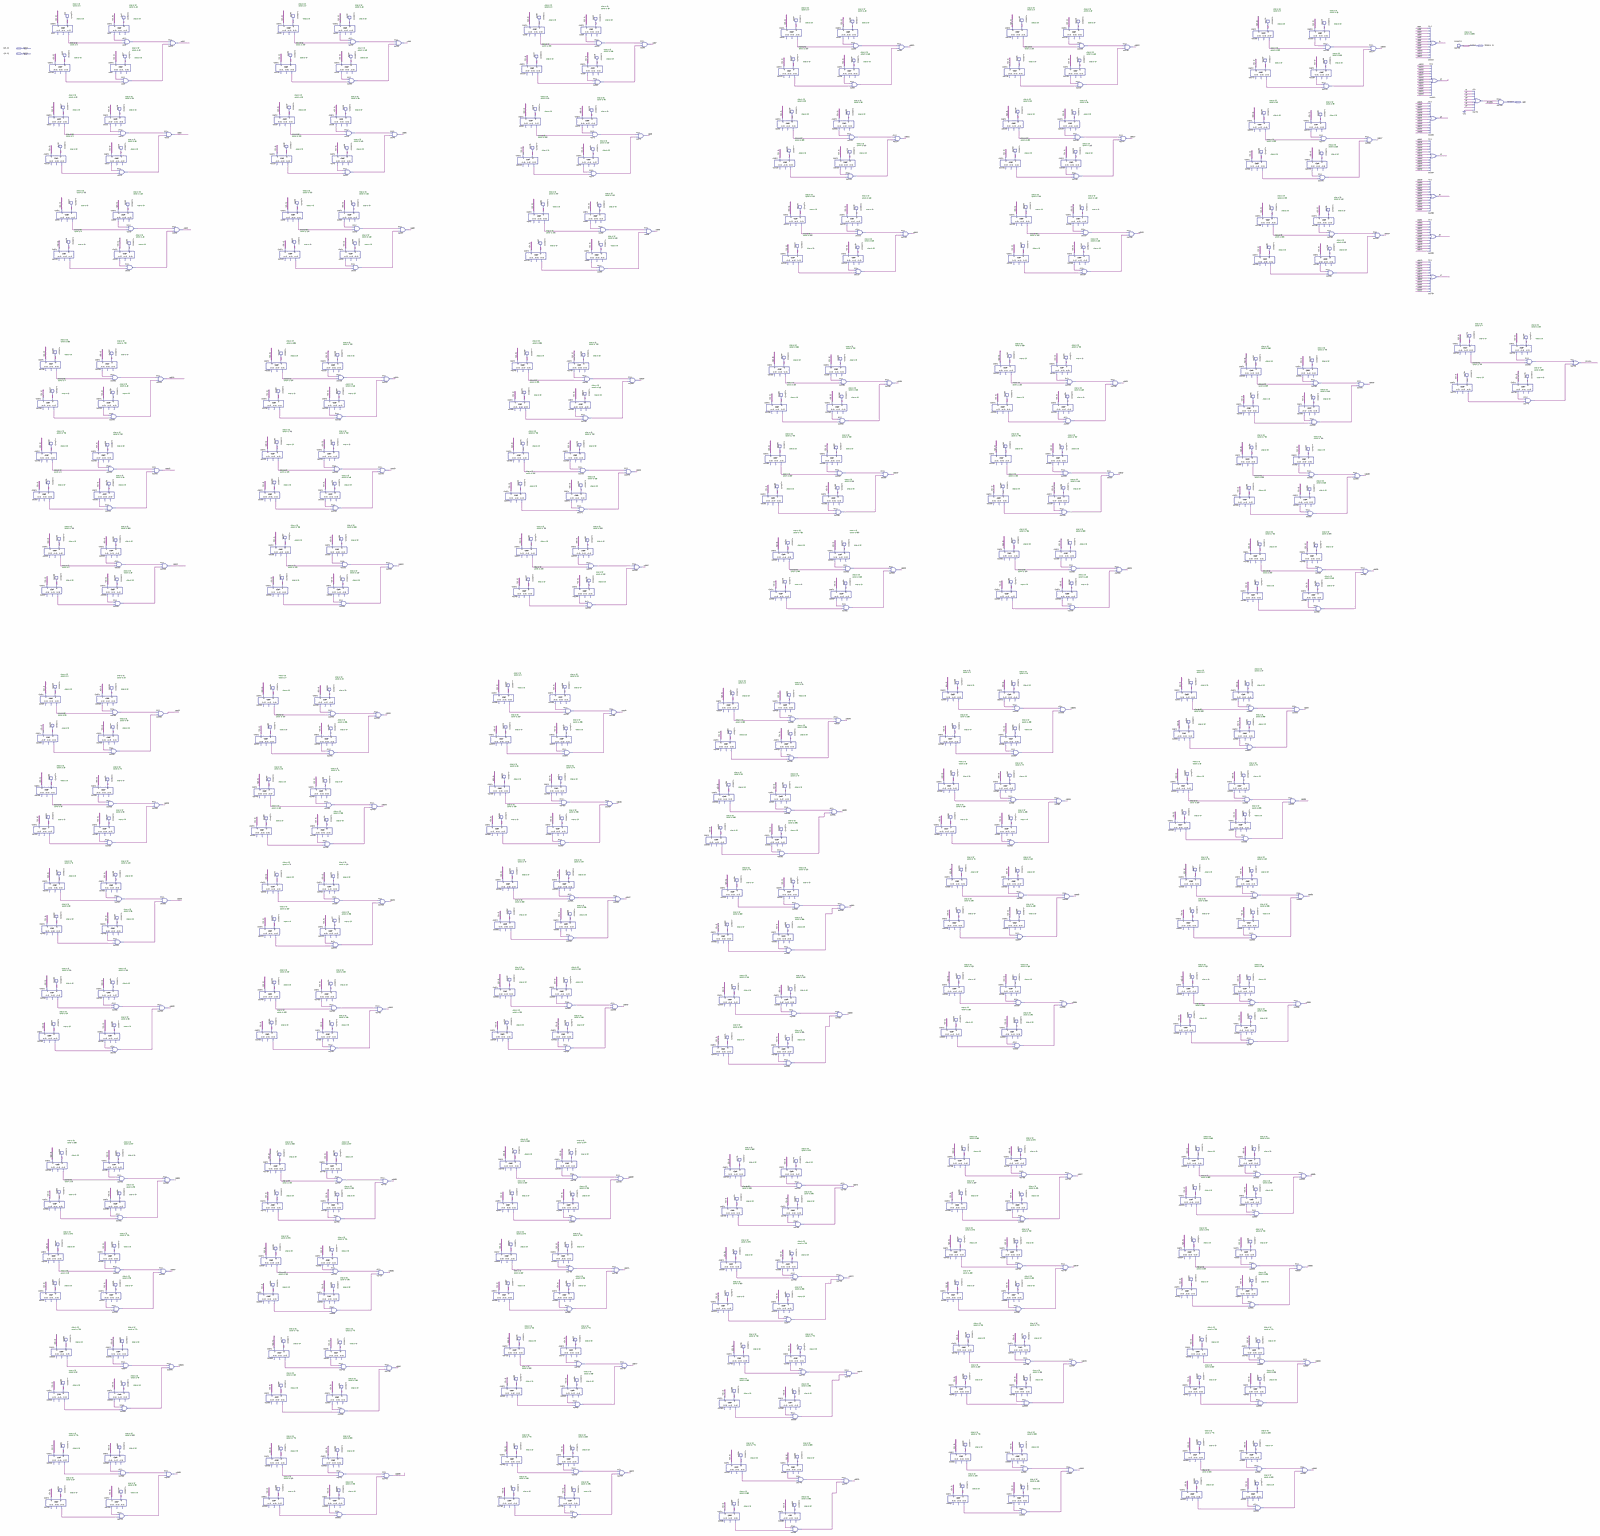
[diagram p0: schematic sheet, whole]
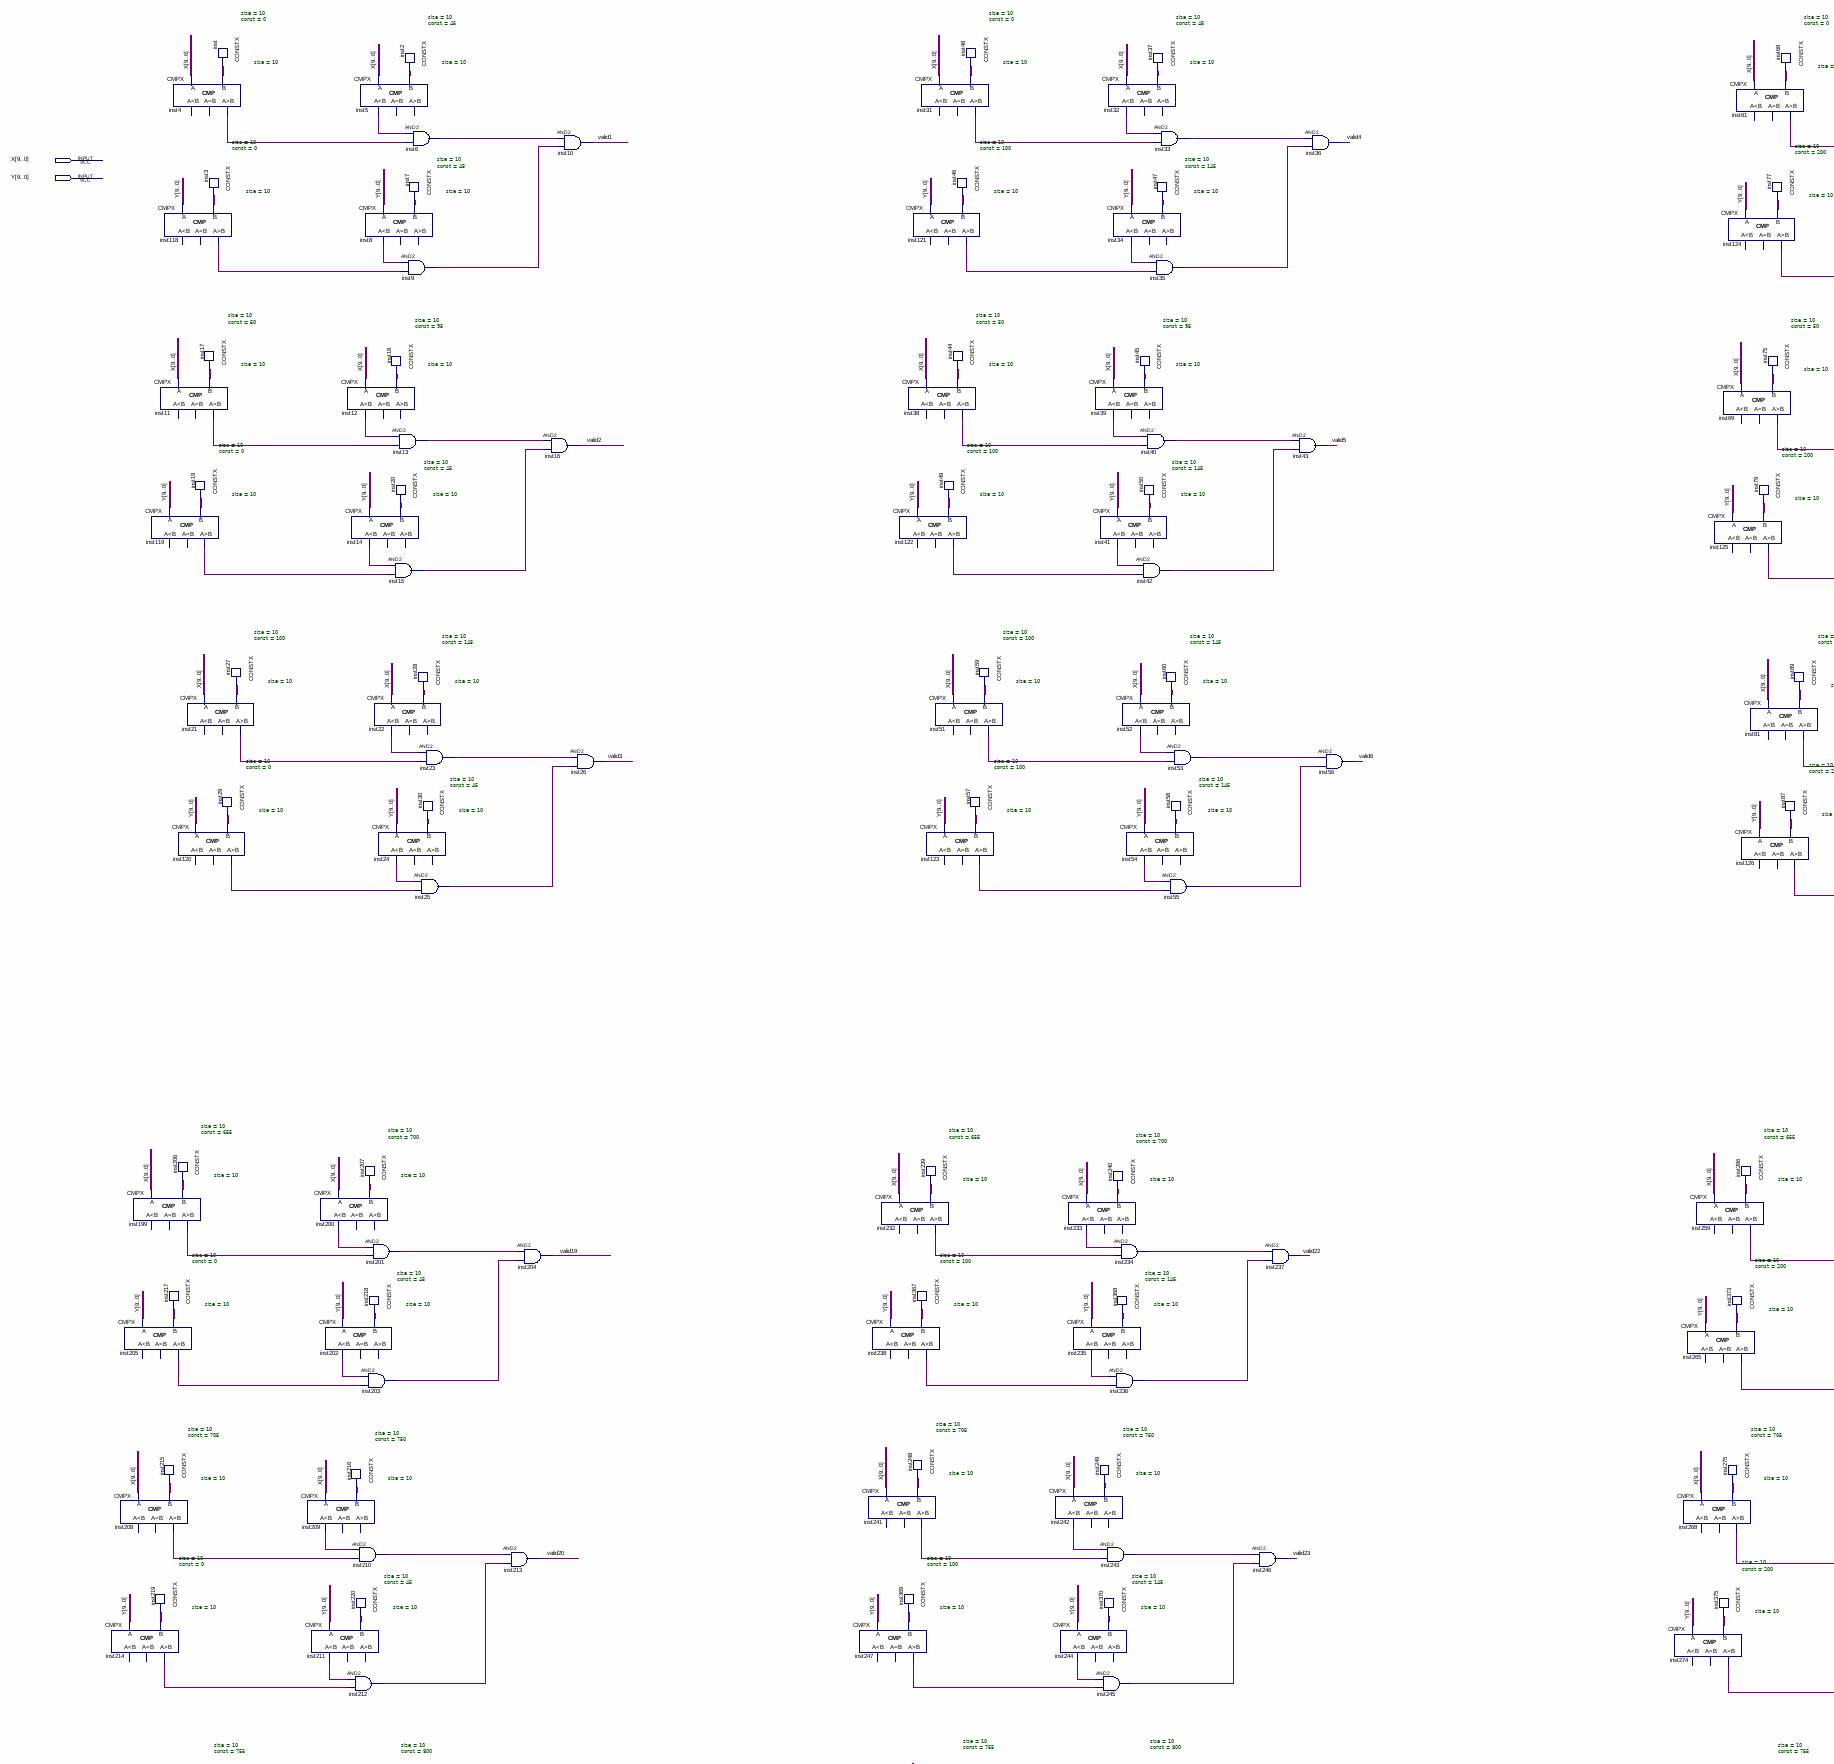
[diagram p1: schematic sheet, upper left part]
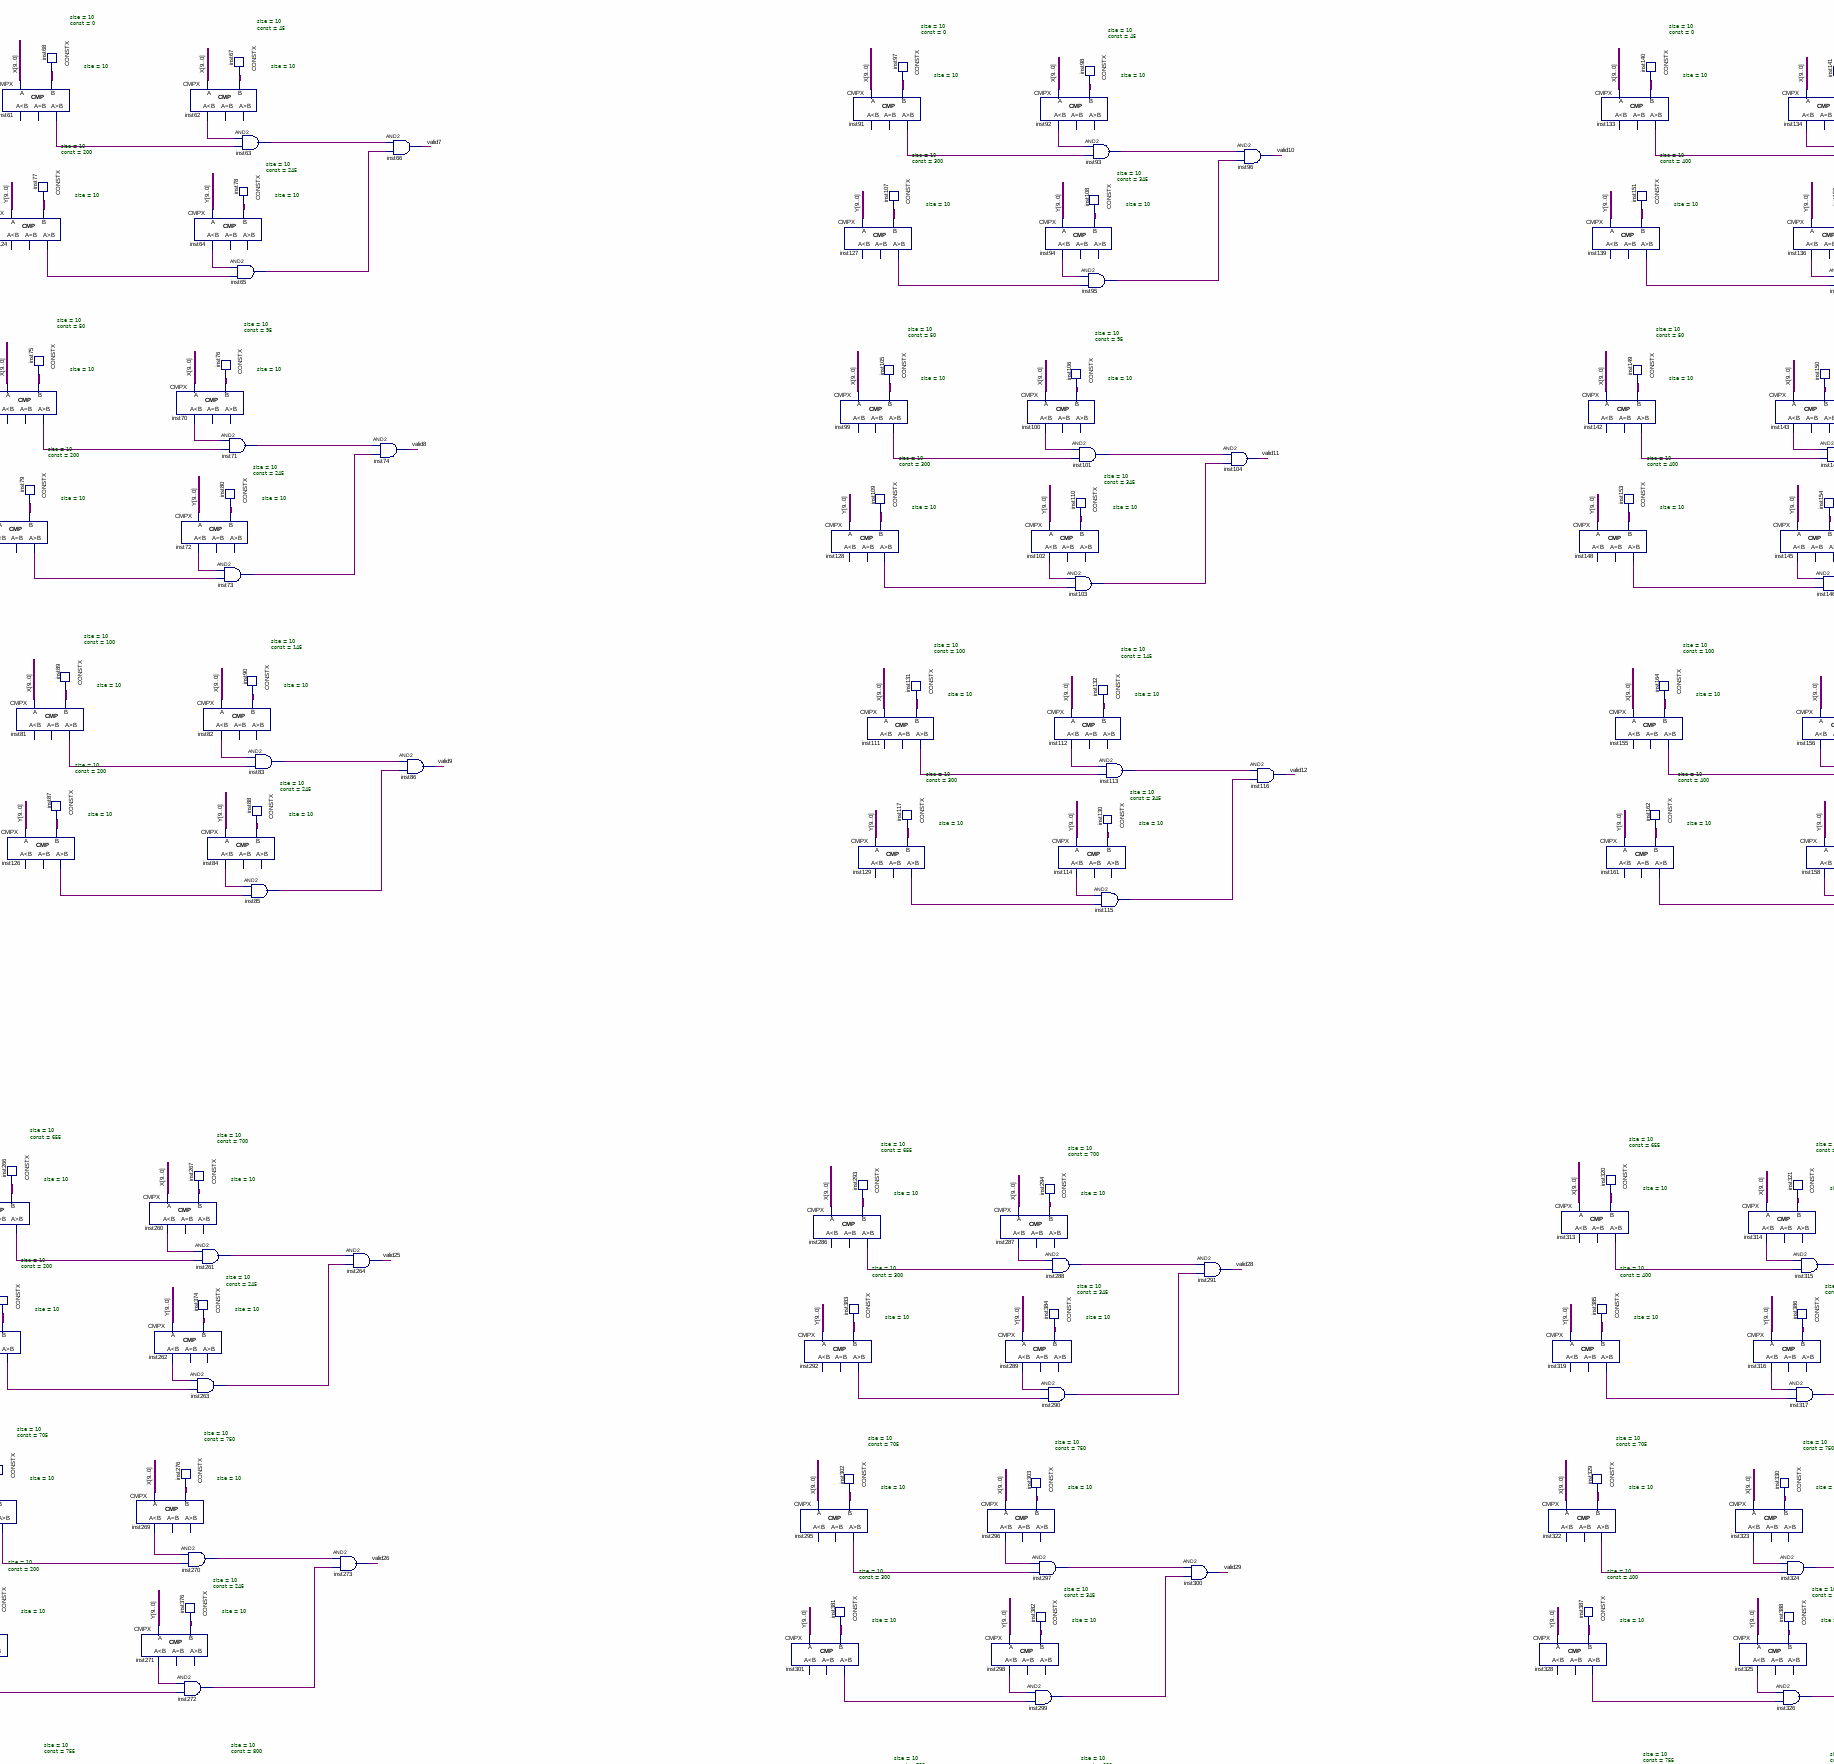
[diagram p2: schematic sheet, upper centre part]
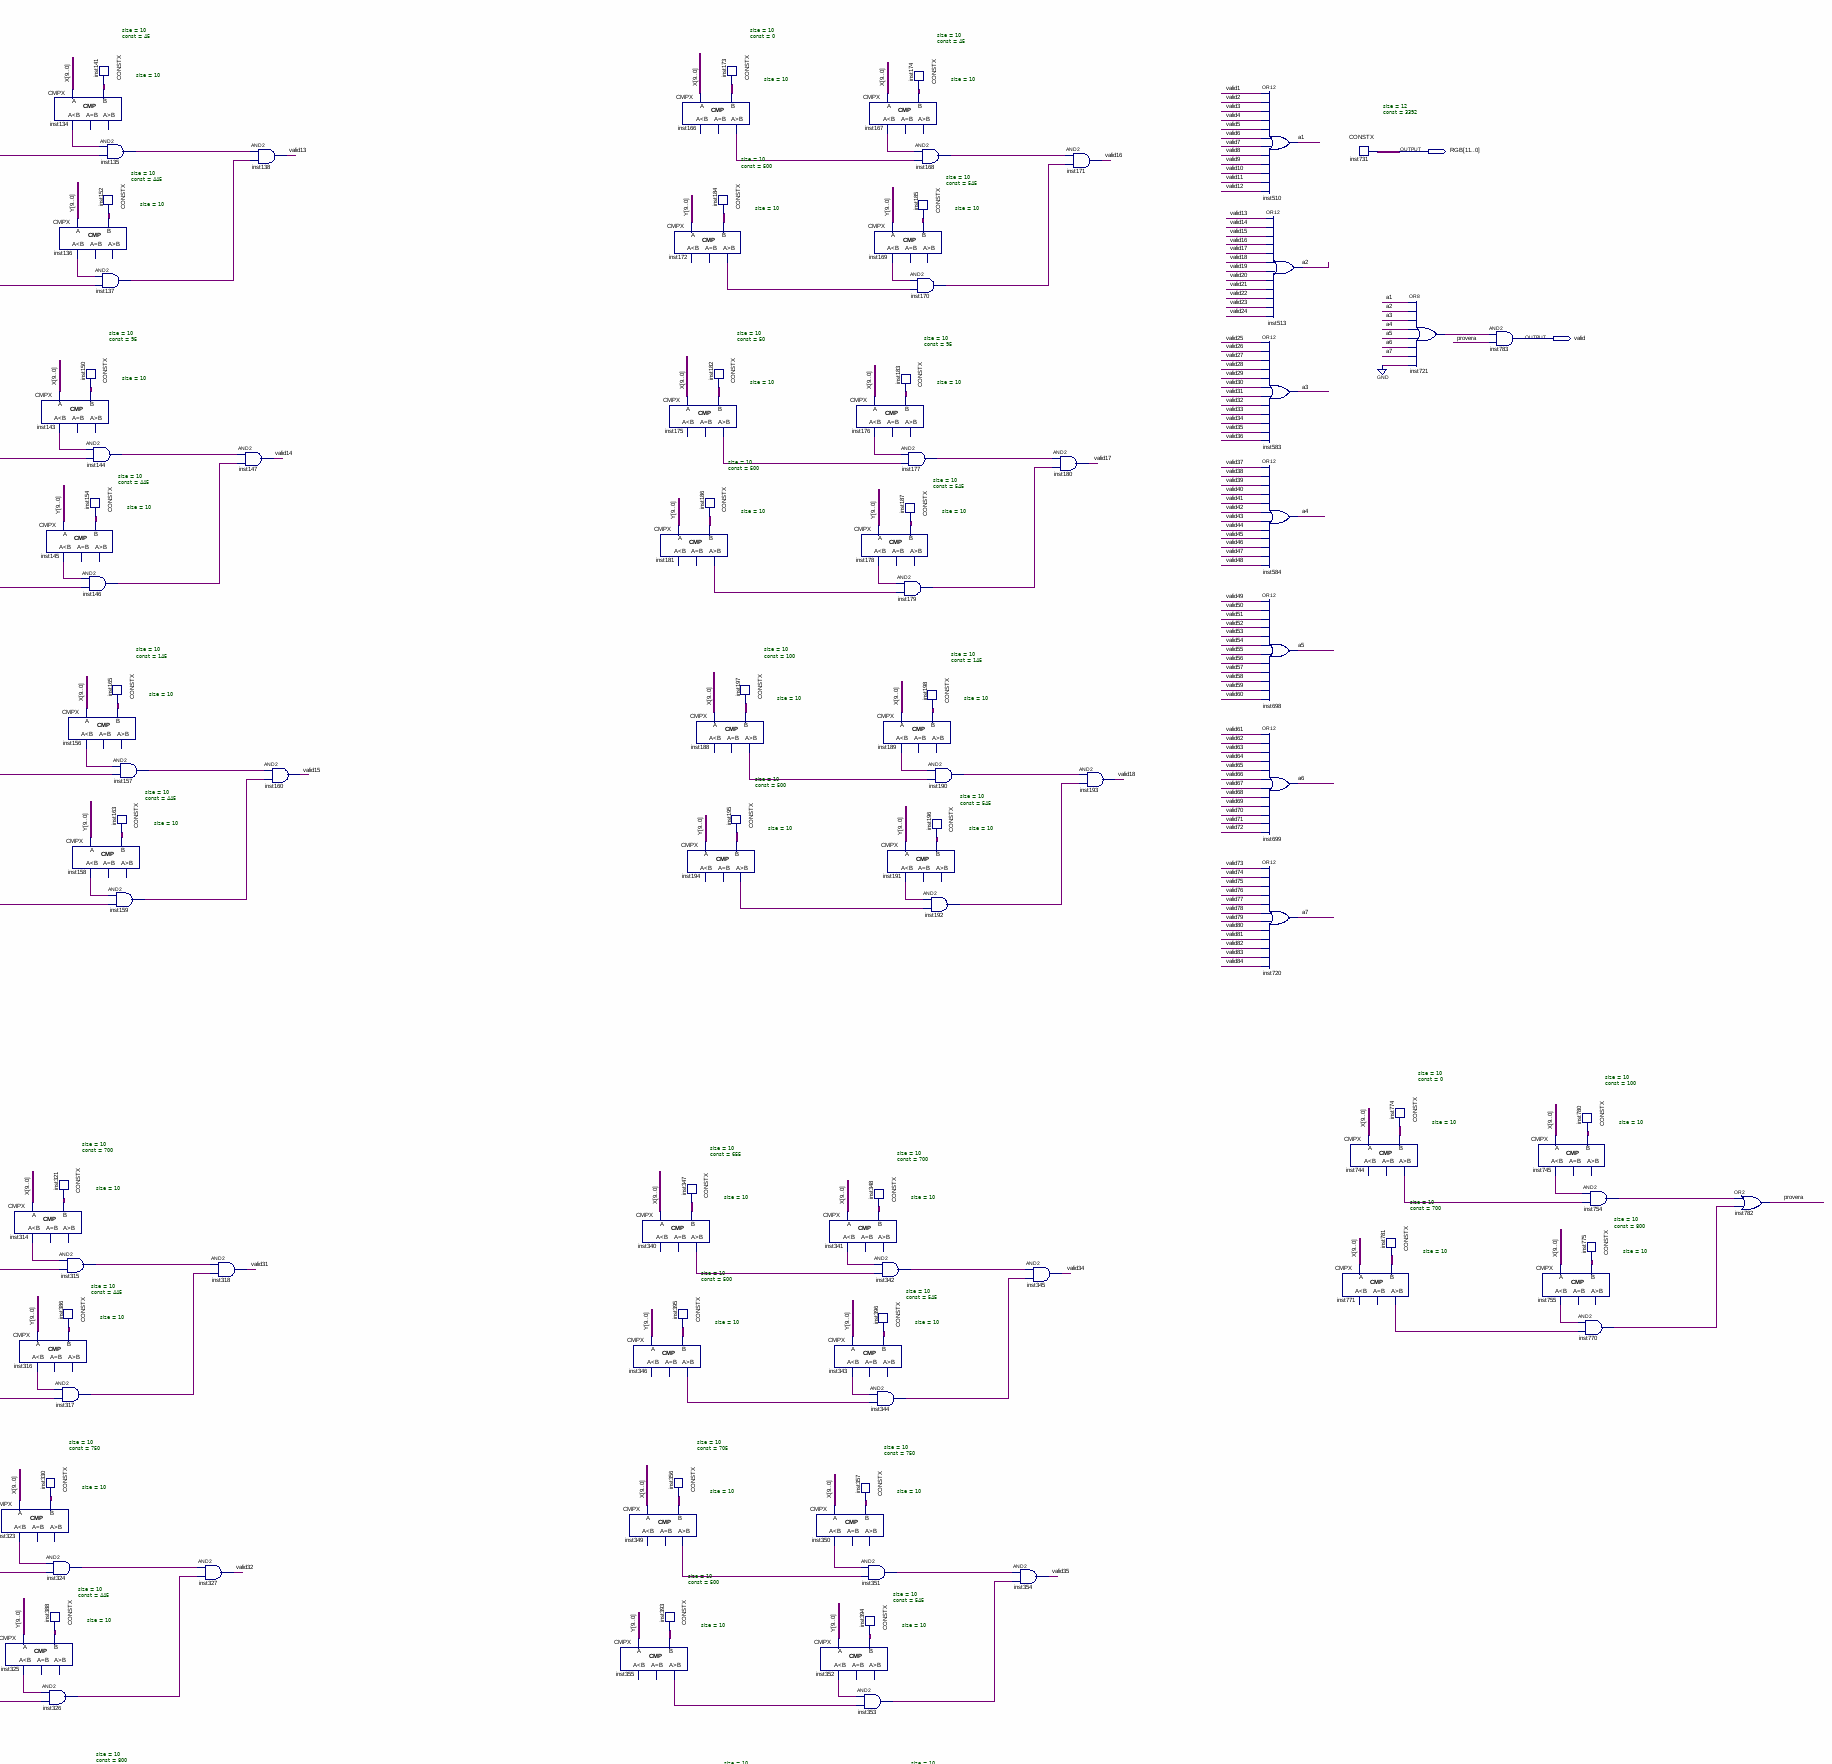
[diagram p3: schematic sheet, upper right part]
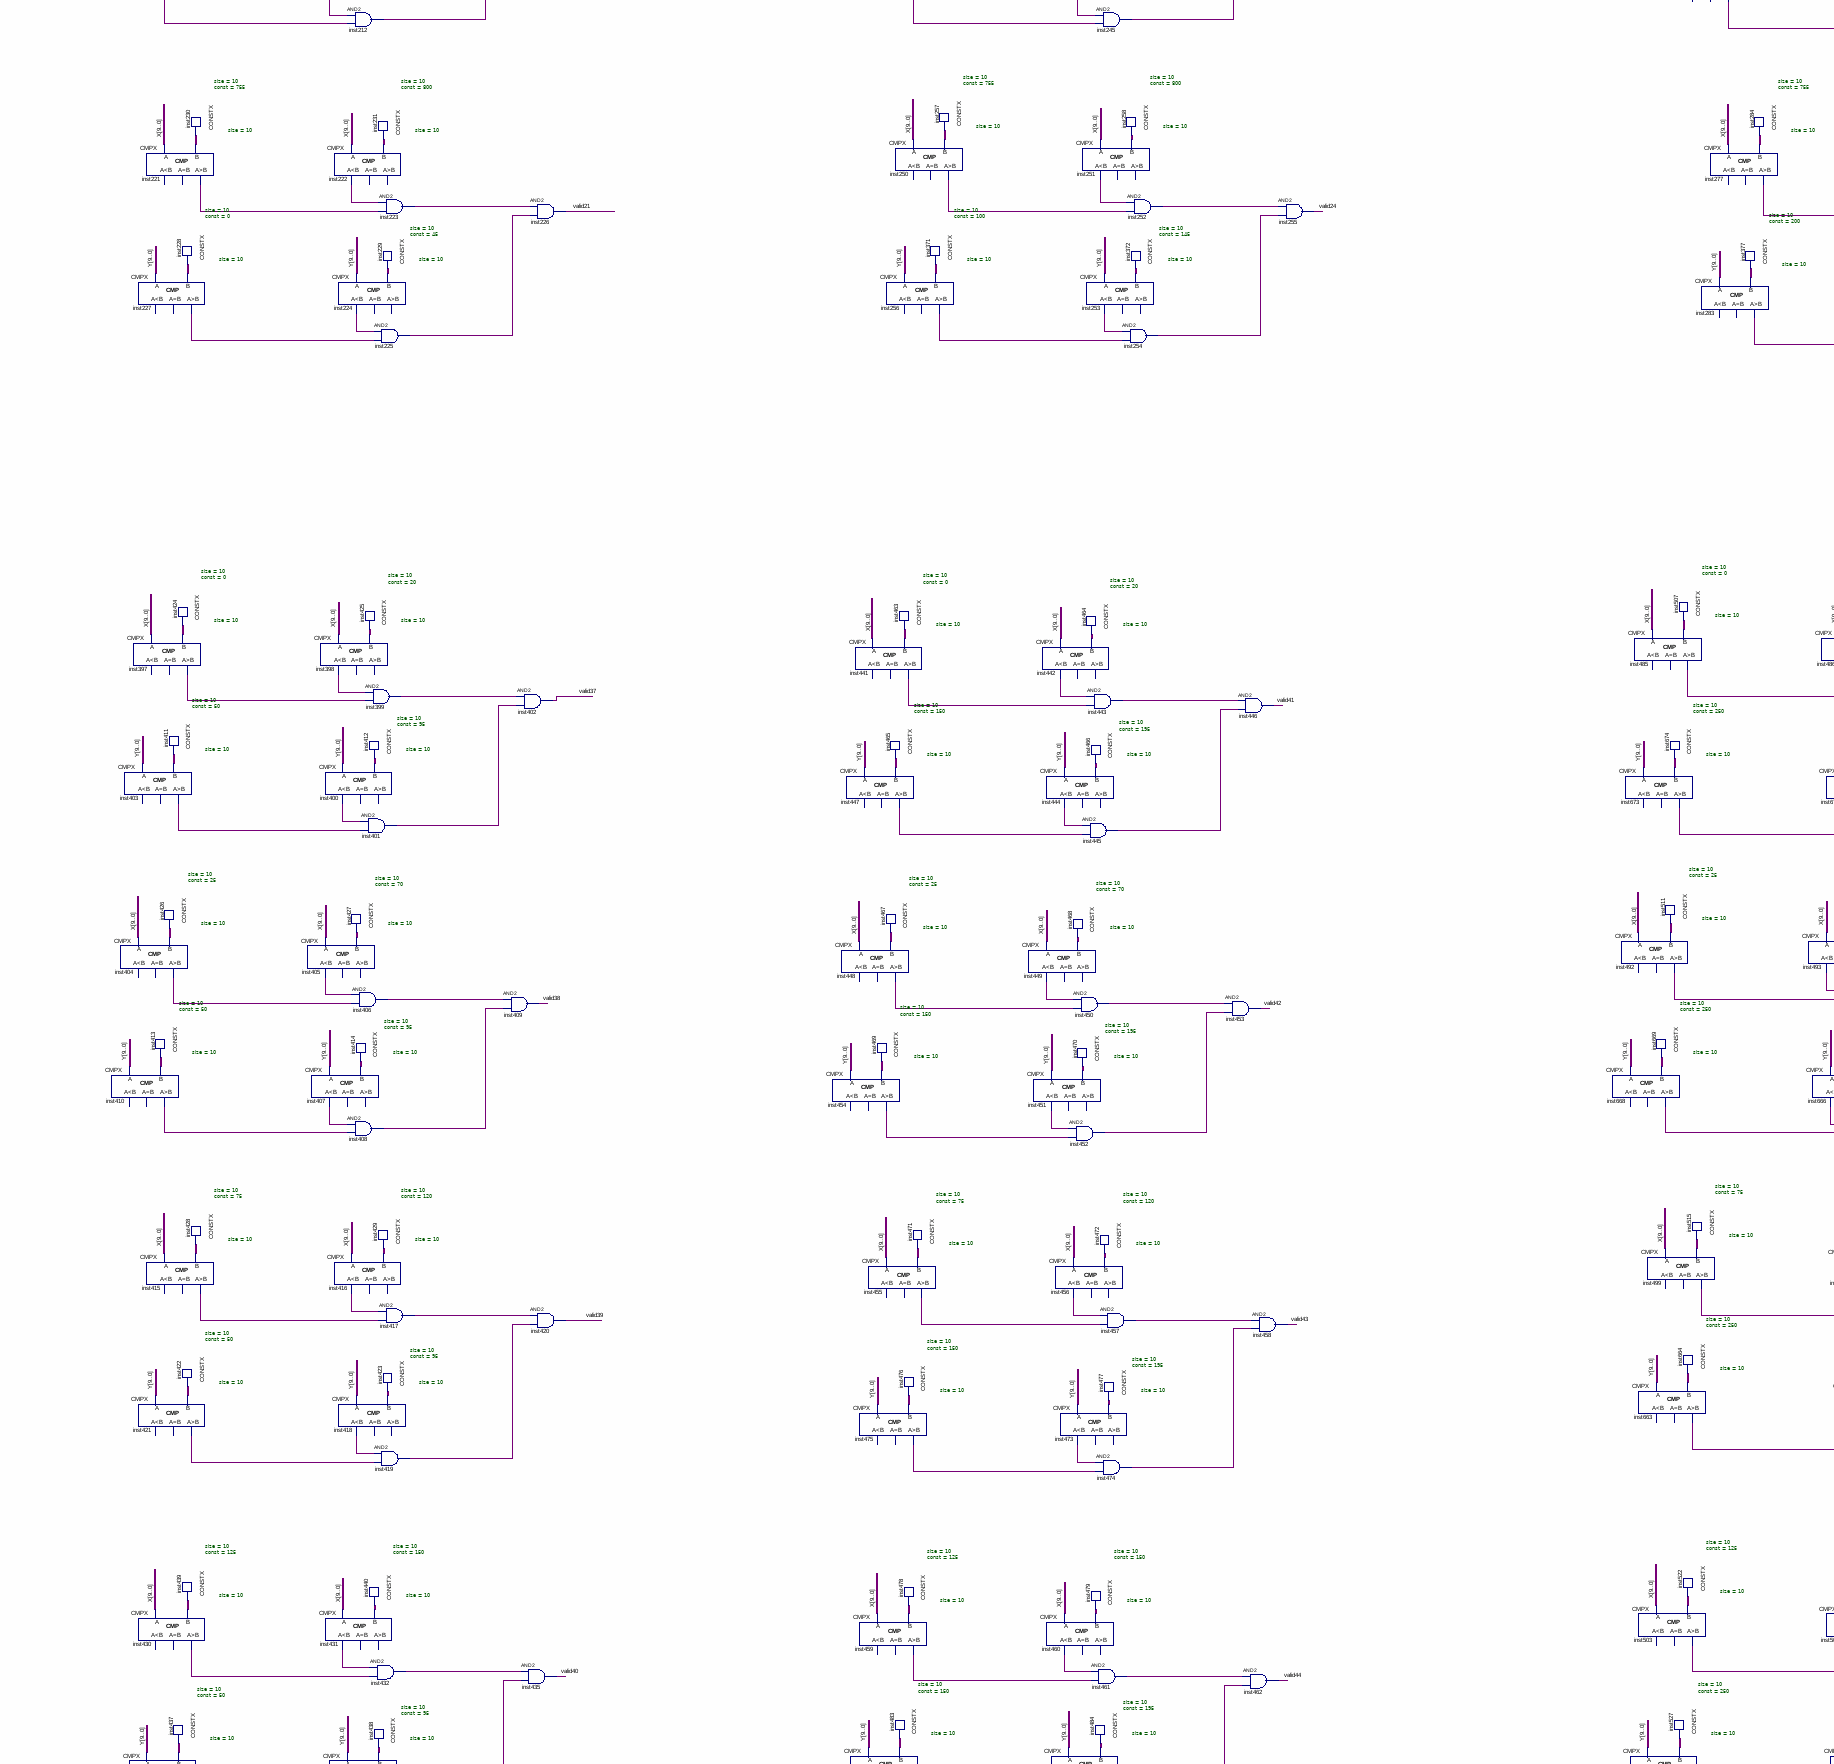
[diagram p4: schematic sheet, middle left part]
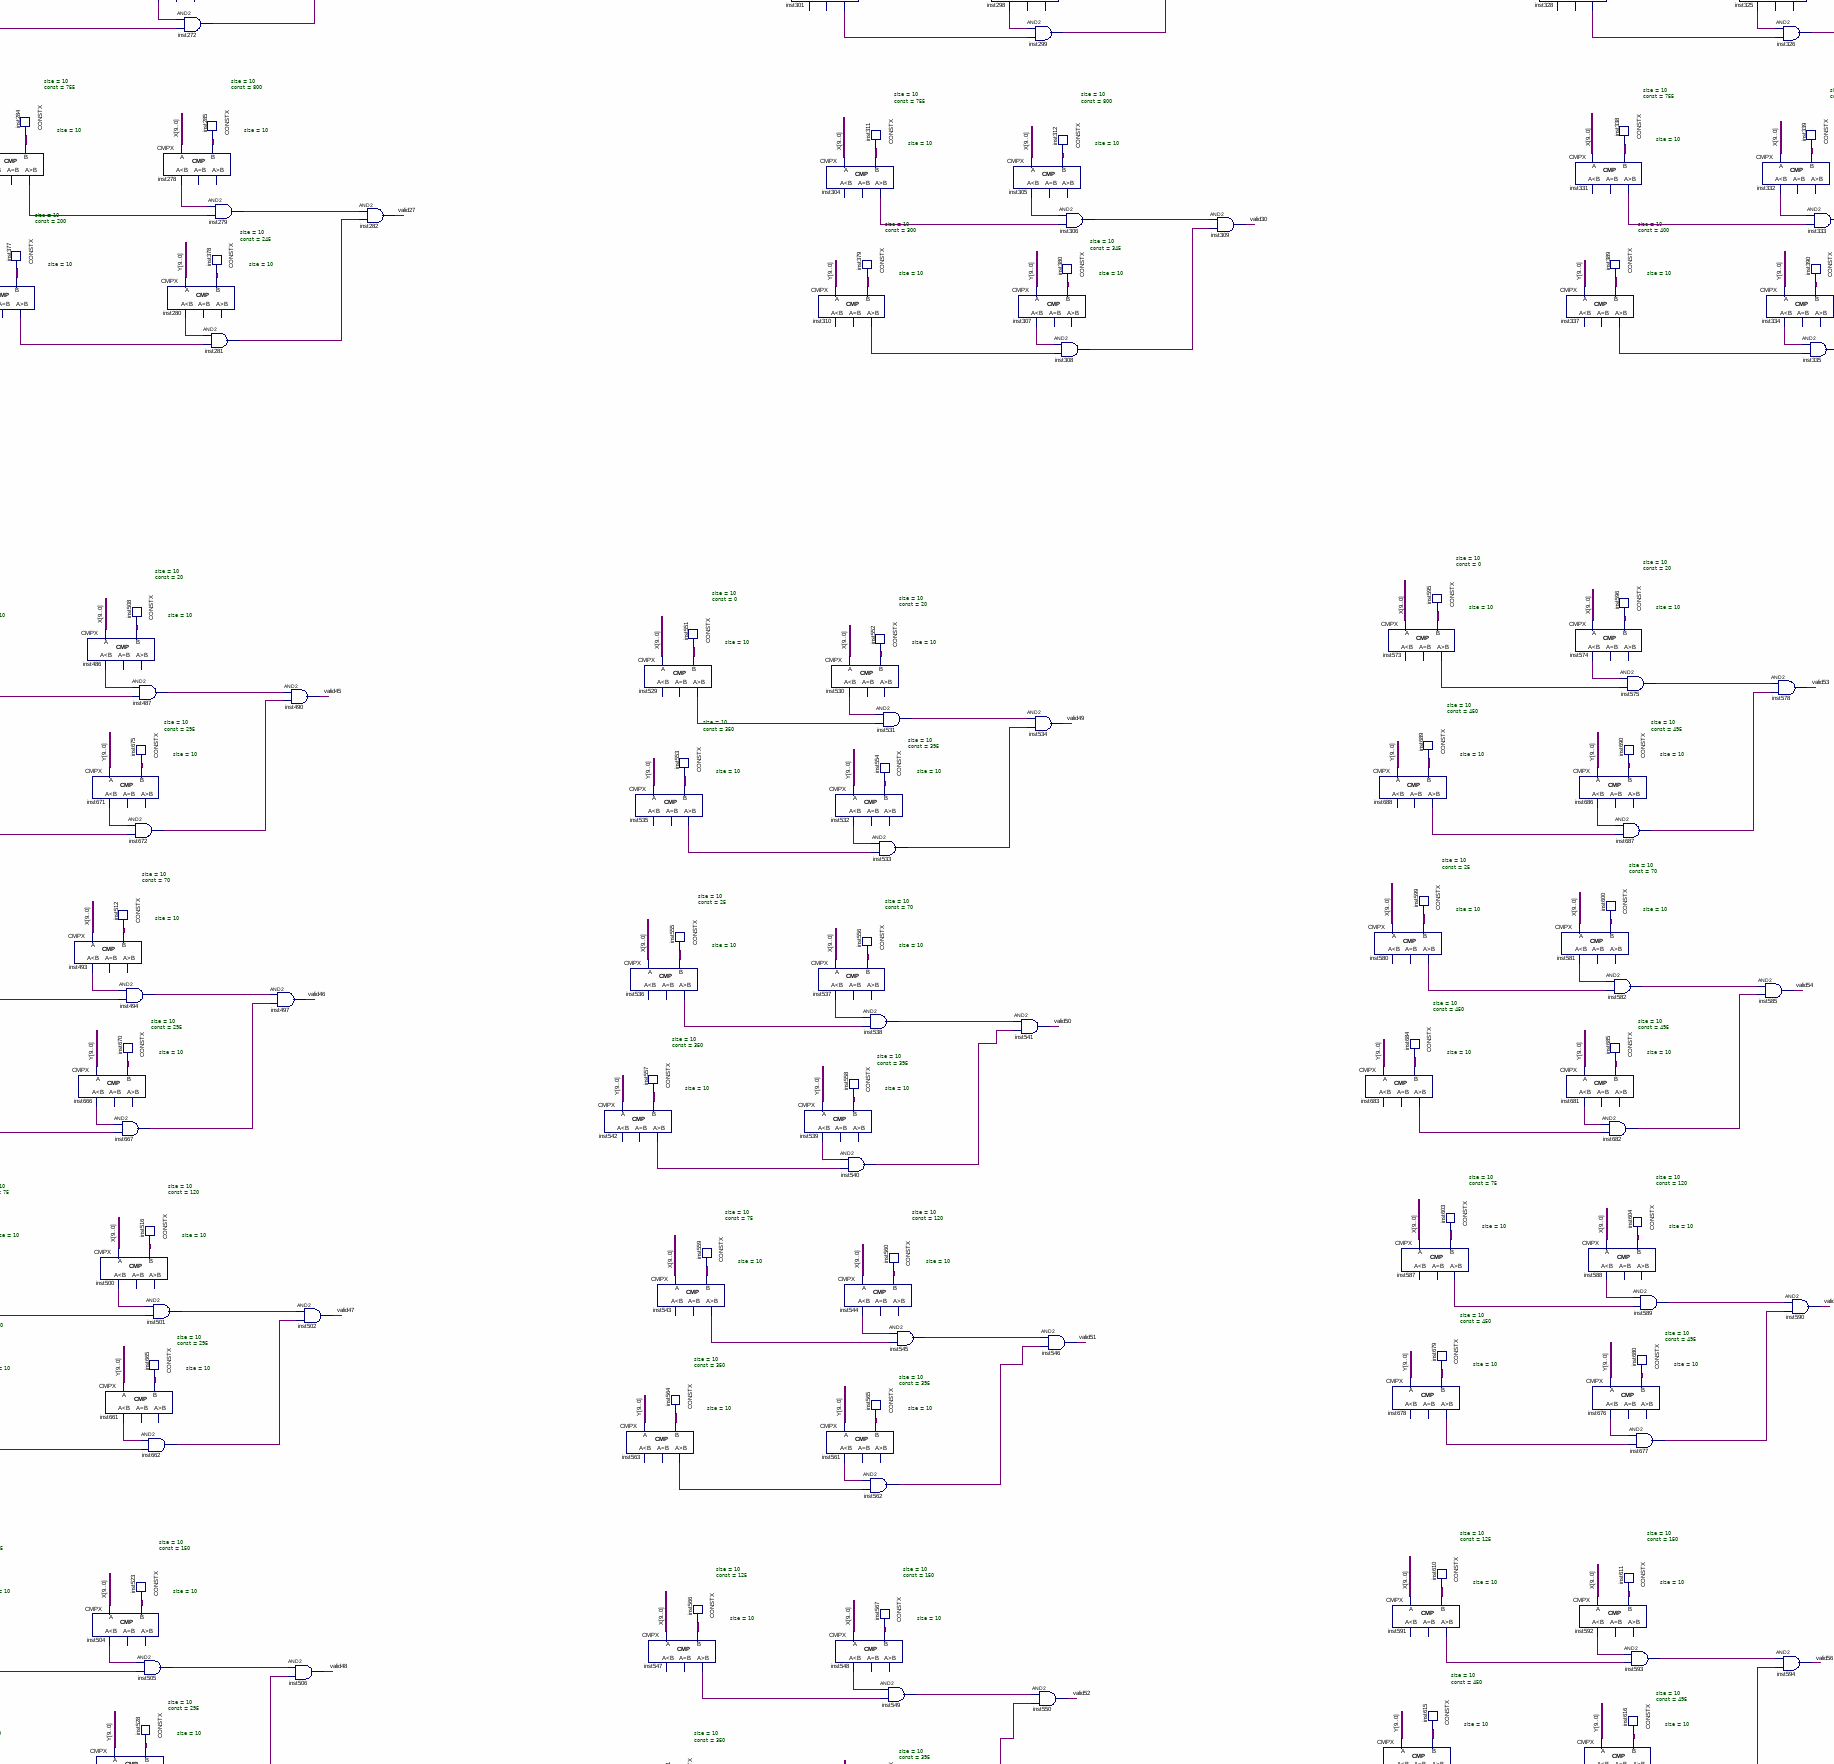
[diagram p5: schematic sheet, middle centre part]
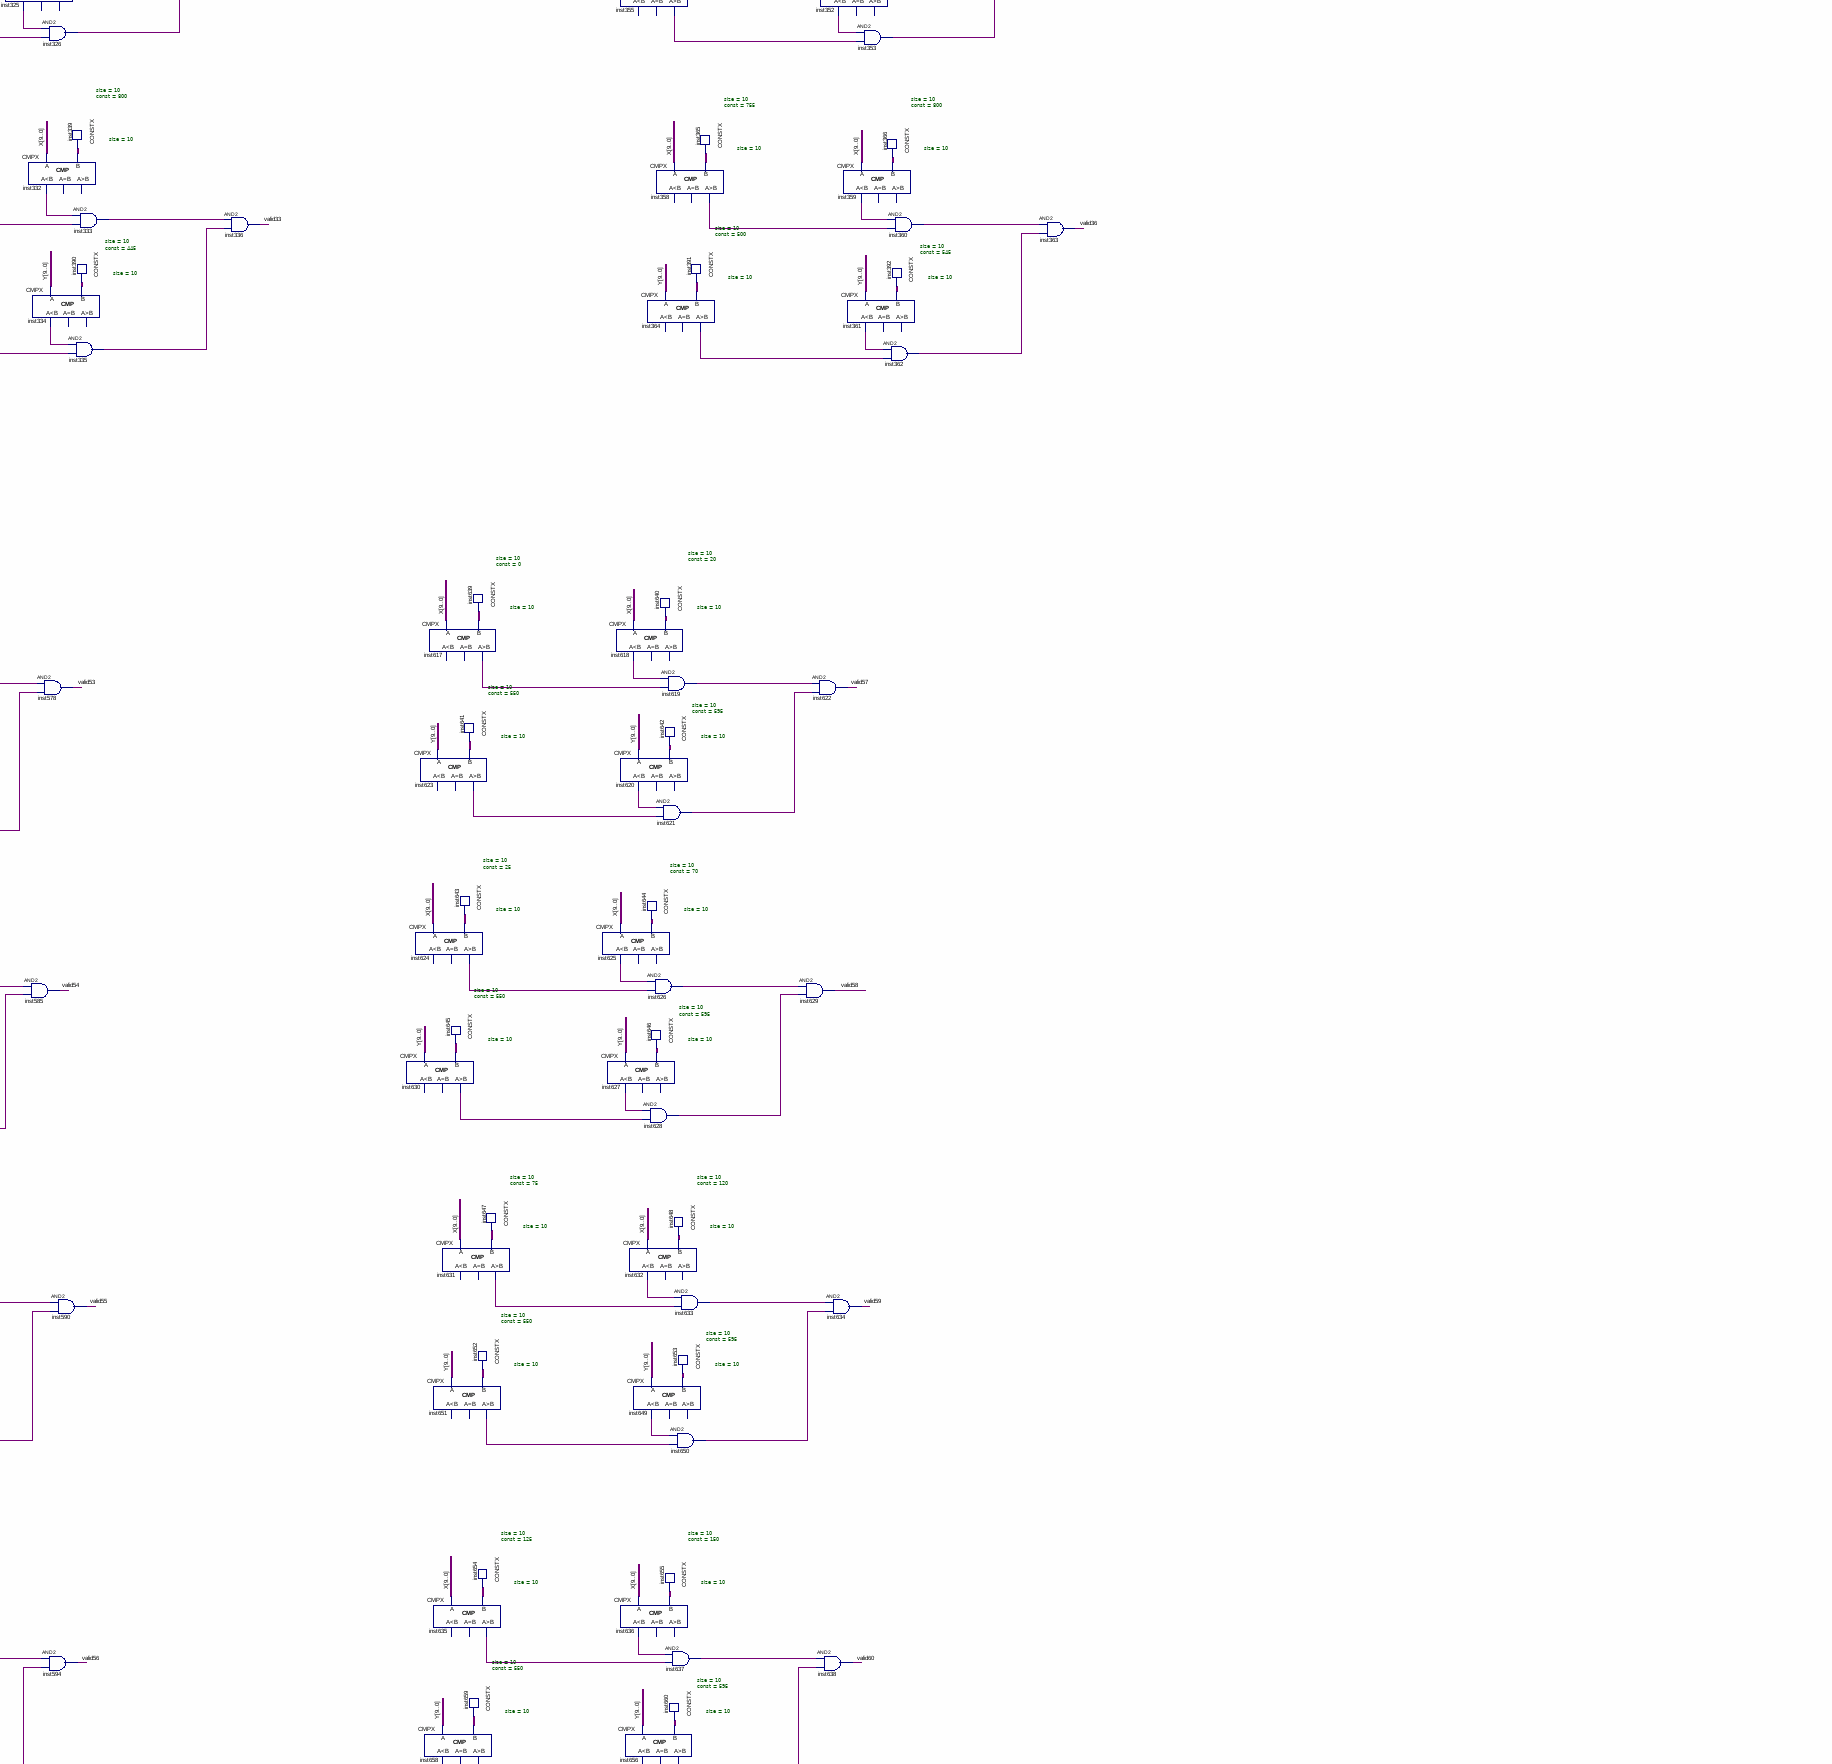
[diagram p6: schematic sheet, middle right part]
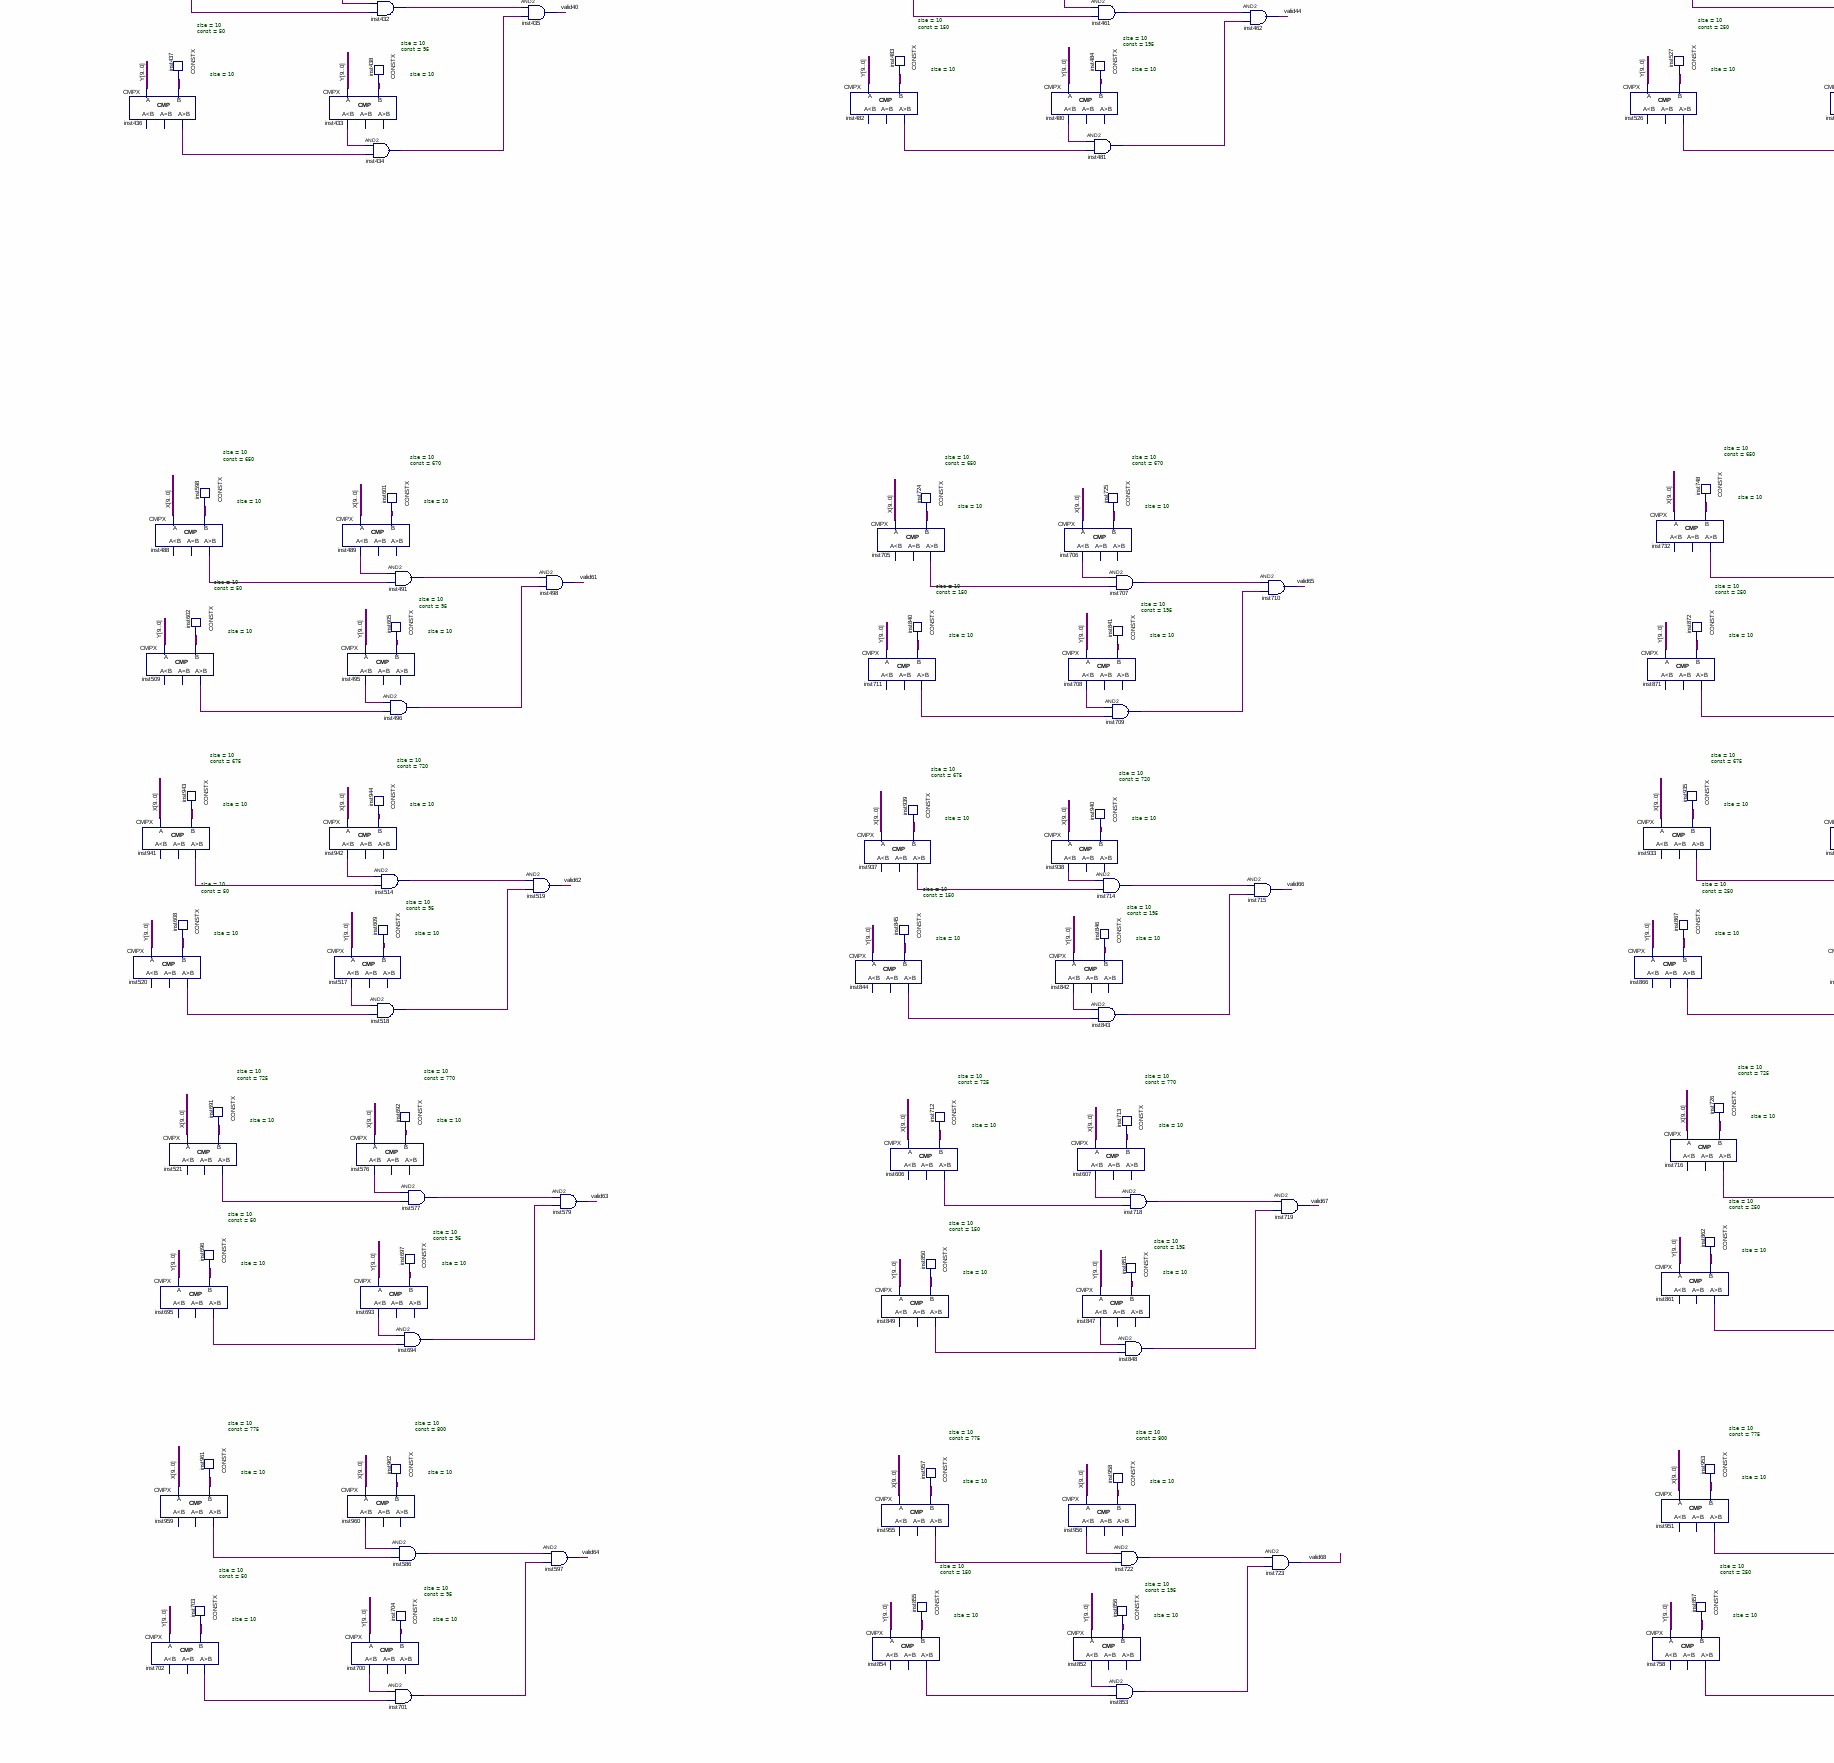
[diagram p7: schematic sheet, lower left part]
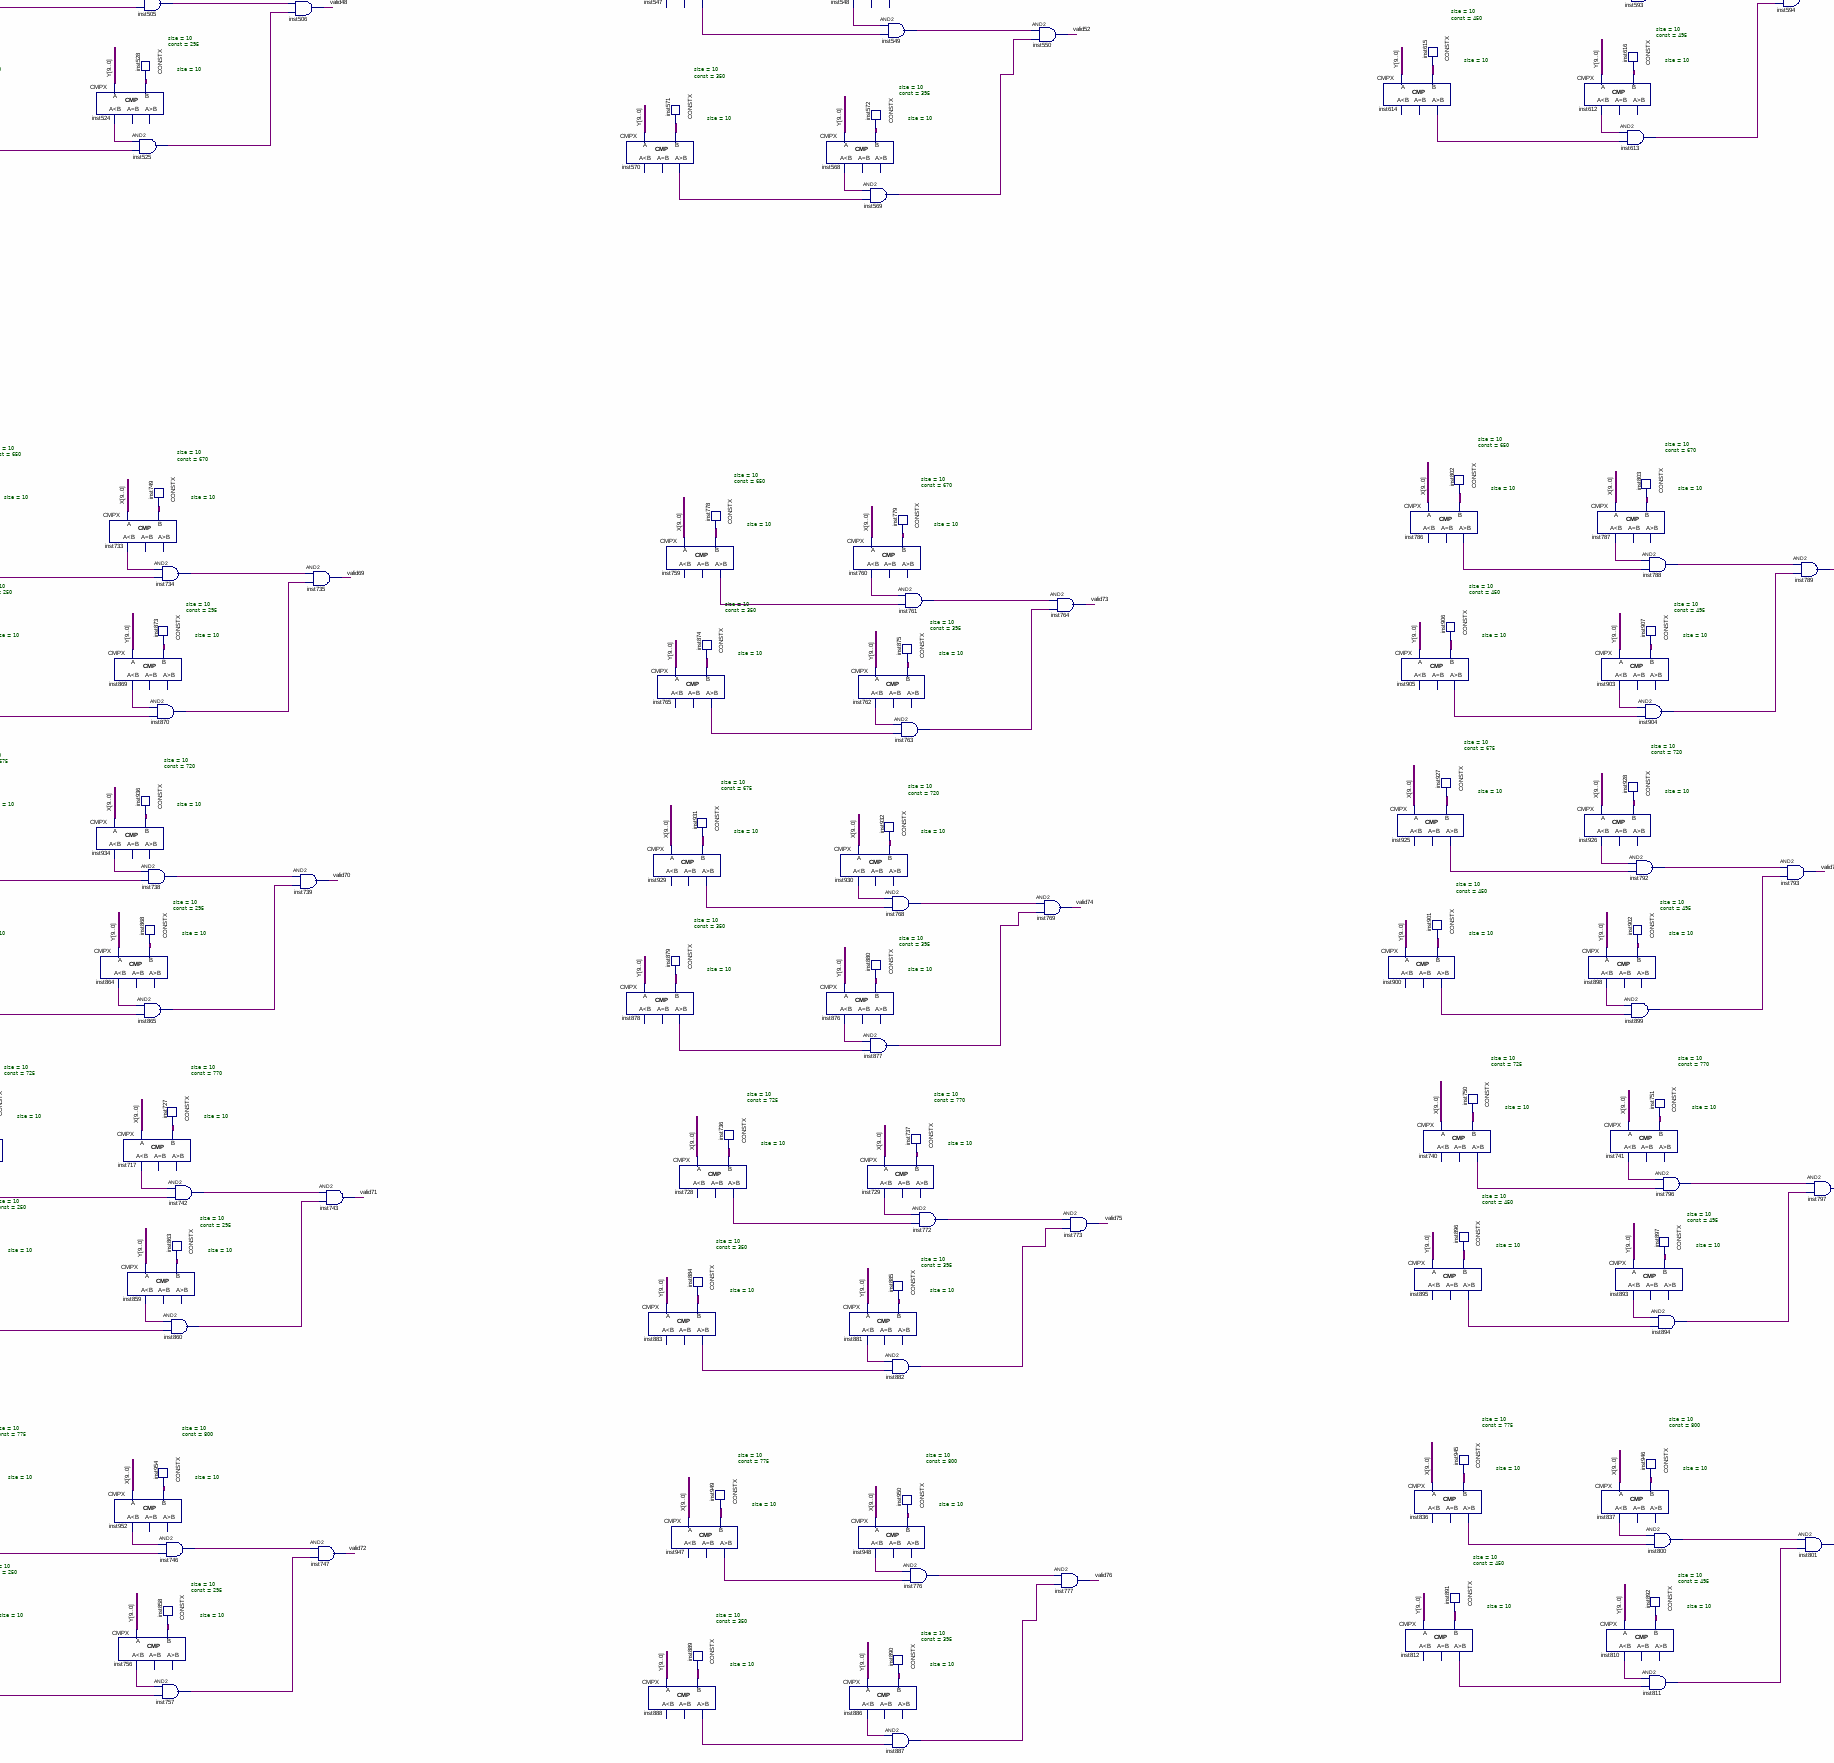
[diagram p8: schematic sheet, lower centre part]
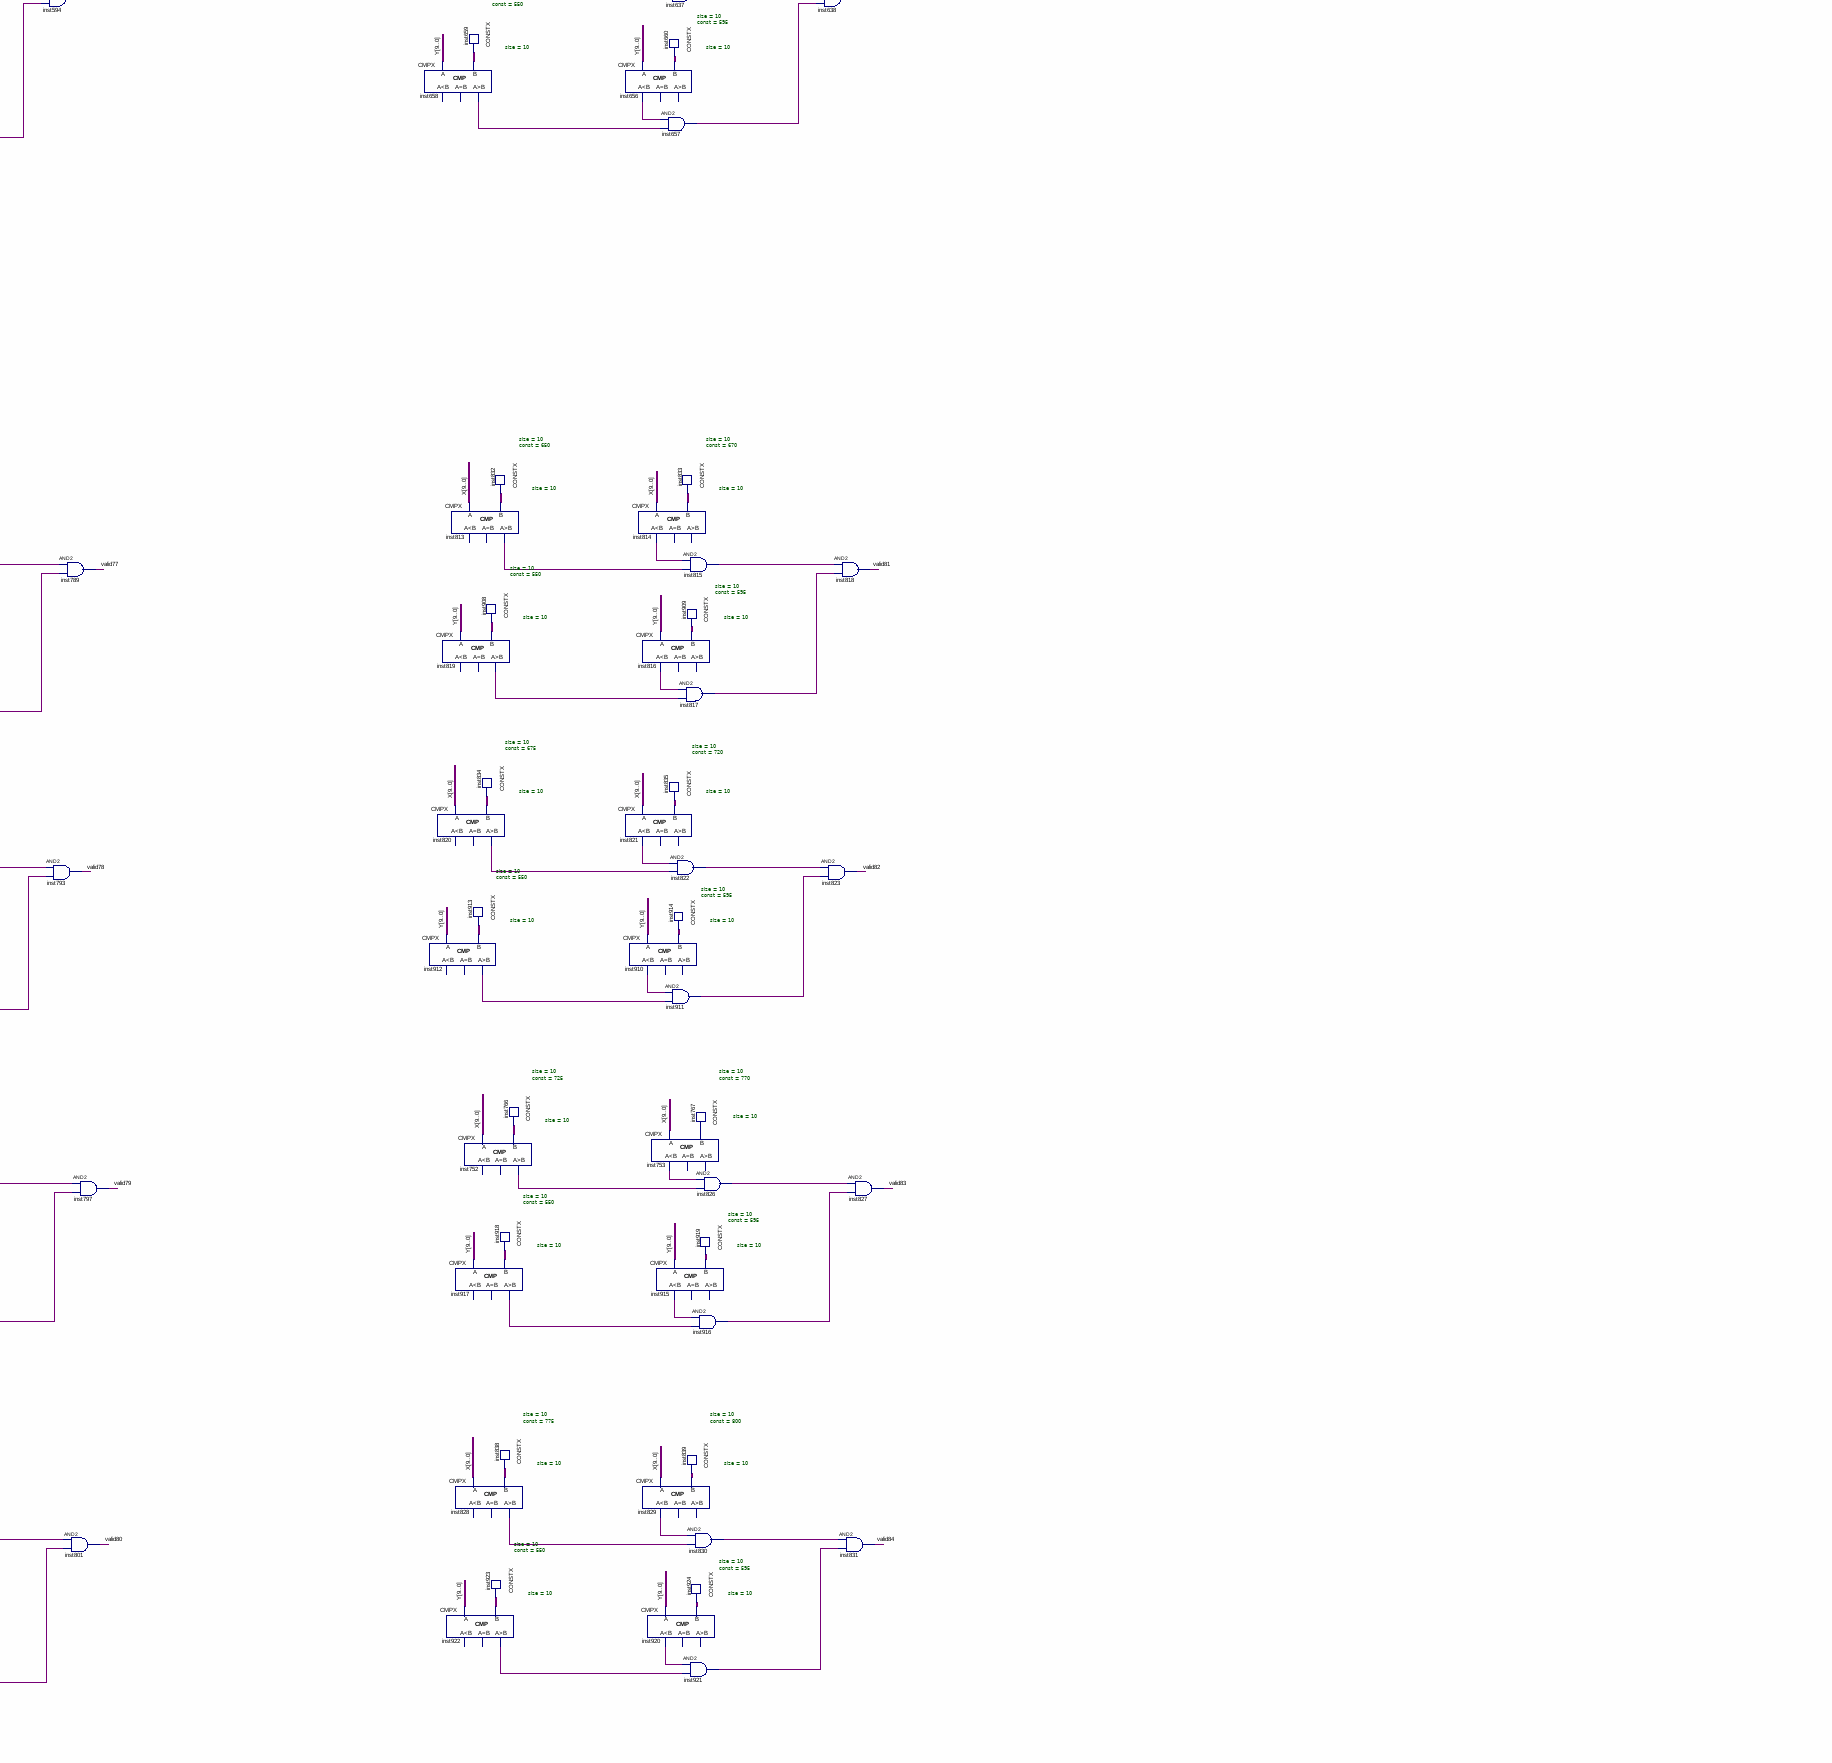
[diagram p9: schematic sheet, lower right part]
// Quartus schematic Zidovi.bdf as structural Verilog: 945 symbols, 4 pins
module Zidovi (
  input  [9:0] X,
  input  [9:0] Y,
  output [11:0] RGB,
  output valid
);

  wire a1, a2, a3, a4, a5, a6, a7, inst4_gr, inst5_ls, inst6_out, inst8_ls, inst9_out, inst11_gr, inst12_ls,
       inst13_out, inst14_ls, inst15_out, inst21_gr, inst22_ls, inst23_out, inst24_ls, inst25_out, inst31_gr,
       inst32_ls, inst33_out, inst34_ls, inst35_out, inst38_gr, inst39_ls, inst40_out, inst41_ls, inst42_out,
       inst51_gr, inst52_ls, inst53_out, inst54_ls, inst55_out, inst61_gr, inst62_ls, inst63_out, inst64_ls,
       inst65_out, inst69_gr, inst70_ls, inst71_out, inst72_ls, inst73_out, inst81_gr, inst82_ls, inst83_out,
       inst84_ls, inst85_out, inst91_gr, inst92_ls, inst93_out, inst94_ls, inst95_out, inst99_gr, inst100_ls,
       inst101_out, inst102_ls, inst103_out, inst111_gr, inst112_ls, inst113_out, inst114_ls, inst115_out,
       inst118_gr, inst119_gr, inst120_gr, inst121_gr, inst122_gr, inst123_gr, inst124_gr, inst125_gr,
       inst126_gr, inst127_gr, inst128_gr, inst129_gr, inst133_gr, inst134_ls, inst135_out, inst136_ls,
       inst137_out, inst139_gr, inst142_gr, inst143_ls, inst144_out, inst145_ls, inst146_out, inst148_gr,
       inst155_gr, inst156_ls, inst157_out, inst158_ls, inst159_out, inst161_gr, inst166_gr, inst167_ls,
       inst168_out, inst169_ls, inst170_out, inst172_gr, inst175_gr, inst176_ls, inst177_out, inst178_ls,
       inst179_out, inst181_gr, inst188_gr, inst189_ls, inst190_out, inst191_ls, inst192_out, inst194_gr,
       inst199_gr, inst200_ls, inst201_out, inst202_ls, inst203_out, inst205_gr, inst208_gr, inst209_ls,
       inst210_out, inst211_ls, inst212_out, inst214_gr, inst221_gr, inst222_ls, inst223_out, inst224_ls,
       inst225_out, inst227_gr, inst232_gr, inst233_ls, inst234_out, inst235_ls, inst236_out, inst238_gr,
       inst241_gr, inst242_ls, inst243_out, inst244_ls, inst245_out, inst247_gr, inst250_gr, inst251_ls,
       inst252_out, inst253_ls, inst254_out, inst256_gr, inst259_gr, inst260_ls, inst261_out, inst262_ls,
       inst263_out, inst265_gr, inst268_gr, inst269_ls, inst270_out, inst271_ls, inst272_out, inst274_gr,
       inst277_gr, inst278_ls, inst279_out, inst280_ls, inst281_out, inst283_gr, inst286_gr, inst287_ls,
       inst288_out, inst289_ls, inst290_out, inst292_gr, inst295_gr, inst296_ls, inst297_out, inst298_ls,
       inst299_out, inst301_gr, inst304_gr, inst305_ls, inst306_out, inst307_ls, inst308_out, inst310_gr,
       inst313_gr, inst314_ls, inst315_out, inst316_ls, inst317_out, inst319_gr, inst322_gr, inst323_ls,
       inst324_out, inst325_ls, inst326_out, inst328_gr, inst331_gr, inst332_ls, inst333_out, inst334_ls,
       inst335_out, inst337_gr, inst340_gr, inst341_ls, inst342_out, inst343_ls, inst344_out, inst346_gr,
       inst349_gr, inst350_ls, inst351_out, inst352_ls, inst353_out, inst355_gr, inst358_gr, inst359_ls,
       inst360_out, inst361_ls, inst362_out, inst364_gr, inst397_gr, inst398_ls, inst399_out, inst400_ls,
       inst401_out, inst403_gr, inst404_gr, inst405_ls, inst406_out, inst407_ls, inst408_out, inst410_gr,
       inst415_gr, inst416_ls, inst417_out, inst418_ls, inst419_out, inst421_gr, inst430_gr, inst431_ls,
       inst432_out, inst433_ls, inst434_out, inst436_gr, inst441_gr, inst442_ls, inst443_out, inst444_ls,
       inst445_out, inst447_gr, inst448_gr, inst449_ls, inst450_out, inst451_ls, inst452_out, inst454_gr,
       inst455_gr, inst456_ls, inst457_out, inst459_gr, inst460_ls, inst461_out, inst473_ls, inst474_out,
       inst475_gr, inst480_ls, inst481_out, inst482_gr, inst485_gr, inst486_ls, inst487_out, inst488_gr,
       inst489_ls, inst491_out, inst492_gr, inst493_ls, inst494_out, inst495_ls, inst496_out, inst499_gr,
       inst500_ls, inst501_out, inst503_gr, inst504_ls, inst505_out, inst509_gr, inst514_out, inst517_ls,
       inst518_out, inst520_gr, inst521_gr, inst524_ls, inst525_out, inst526_gr, inst529_gr, inst530_ls,
       inst531_out, inst532_ls, inst533_out, inst535_gr, inst536_gr, inst537_ls, inst538_out, inst539_ls,
       inst540_out, inst542_gr, inst543_gr, inst544_ls, inst545_out, inst547_gr, inst548_ls, inst549_out,
       inst561_ls, inst562_out, inst563_gr, inst568_ls, inst569_out, inst570_gr, inst573_gr, inst574_ls,
       inst575_out, inst576_ls, inst577_out, inst580_gr, inst581_ls, inst582_out, inst586_out, inst587_gr,
       inst588_ls, inst589_out, inst591_gr, inst592_ls, inst593_out, inst606_gr, inst607_ls, inst612_ls,
       inst613_out, inst614_gr, inst617_gr, inst618_ls, inst619_out, inst620_ls, inst621_out, inst623_gr,
       inst624_gr, inst625_ls, inst626_out, inst627_ls, inst628_out, inst630_gr, inst631_gr, inst632_ls,
       inst633_out, inst635_gr, inst636_ls, inst637_out, inst649_ls, inst650_out, inst651_gr, inst656_ls,
       inst657_out, inst658_gr, inst661_ls, inst662_out, inst663_gr, inst666_ls, inst667_out, inst668_gr,
       inst671_ls, inst672_out, inst673_gr, inst676_ls, inst677_out, inst678_gr, inst681_ls, inst682_out,
       inst683_gr, inst686_ls, inst687_out, inst688_gr, inst693_ls, inst694_out, inst695_gr, inst700_ls,
       inst701_out, inst702_gr, inst705_gr, inst706_ls, inst707_out, inst708_ls, inst709_out, inst711_gr,
       inst714_out, inst716_gr, inst717_ls, inst718_out, inst721_out, inst722_out, inst728_gr, inst729_ls,
       inst732_gr, inst733_ls, inst734_out, inst738_out, inst740_gr, inst741_ls, inst742_out, inst744_gr,
       inst745_ls, inst746_out, inst752_gr, inst753_ls, inst754_out, inst755_ls, inst756_ls, inst757_out,
       inst758_gr, inst759_gr, inst760_ls, inst761_out, inst762_ls, inst763_out, inst765_gr, inst768_out,
       inst770_out, inst771_gr, inst772_out, inst776_out, inst786_gr, inst787_ls, inst788_out, inst792_out,
       inst796_out, inst800_out, inst810_ls, inst811_out, inst812_gr, inst813_gr, inst814_ls, inst815_out,
       inst816_ls, inst817_out, inst819_gr, inst820_gr, inst821_ls, inst822_out, inst826_out, inst828_gr,
       inst829_ls, inst830_out, inst836_gr, inst837_ls, inst842_ls, inst843_out, inst844_gr, inst847_ls,
       inst848_out, inst849_gr, inst852_ls, inst853_out, inst854_gr, inst859_ls, inst860_out, inst861_gr,
       inst864_ls, inst865_out, inst866_gr, inst869_ls, inst870_out, inst871_gr, inst876_ls, inst877_out,
       inst878_gr, inst881_ls, inst882_out, inst883_gr, inst886_ls, inst887_out, inst888_gr, inst893_ls,
       inst894_out, inst895_gr, inst898_ls, inst899_out, inst900_gr, inst903_ls, inst904_out, inst905_gr,
       inst910_ls, inst911_out, inst912_gr, inst915_ls, inst916_out, inst917_gr, inst920_ls, inst921_out,
       inst922_gr, inst925_gr, inst926_ls, inst929_gr, inst930_ls, inst933_gr, inst934_ls, inst937_gr,
       inst938_ls, inst941_gr, inst942_ls, inst947_gr, inst948_ls, inst951_gr, inst952_ls, inst955_gr,
       inst956_ls, inst959_gr, inst960_ls, provera, valid1, valid2, valid3, valid4, valid5, valid6, valid7,
       valid8, valid9, valid10, valid11, valid12, valid13, valid14, valid15, valid16, valid17, valid18,
       valid19, valid20, valid21, valid22, valid23, valid24, valid25, valid26, valid27, valid28, valid29,
       valid30, valid31, valid32, valid33, valid34, valid35, valid36, valid37, valid38, valid39, valid40,
       valid41, valid42, valid43, valid44, valid45, valid46, valid47, valid48, valid49, valid50, valid51,
       valid52, valid53, valid54, valid55, valid56, valid57, valid58, valid59, valid60, valid61, valid62,
       valid63, valid64, valid65, valid66, valid67, valid68, valid69, valid70, valid71, valid72, valid73,
       valid74, valid75, valid76, valid77, valid78, valid79, valid80, valid81, valid82, valid83, valid84;
  wire [9:0] inst2_data, inst3_data, inst7_data, inst17_data, inst18_data, inst19_data, inst20_data,
       inst27_data, inst28_data, inst29_data, inst30_data, inst37_data, inst44_data, inst45_data,
       inst46_data, inst47_data, inst48_data, inst49_data, inst50_data, inst57_data, inst58_data,
       inst59_data, inst60_data, inst67_data, inst68_data, inst75_data, inst76_data, inst77_data,
       inst78_data, inst79_data, inst80_data, inst87_data, inst88_data, inst89_data, inst90_data,
       inst97_data, inst98_data, inst105_data, inst106_data, inst107_data, inst108_data, inst109_data,
       inst110_data, inst117_data, inst130_data, inst131_data, inst132_data, inst140_data, inst141_data,
       inst149_data, inst150_data, inst151_data, inst152_data, inst153_data, inst154_data, inst162_data,
       inst163_data, inst164_data, inst165_data, inst173_data, inst174_data, inst182_data, inst183_data,
       inst184_data, inst185_data, inst186_data, inst187_data, inst195_data, inst196_data, inst197_data,
       inst198_data, inst206_data, inst207_data, inst215_data, inst216_data, inst217_data, inst218_data,
       inst219_data, inst220_data, inst228_data, inst229_data, inst230_data, inst231_data, inst239_data,
       inst240_data, inst248_data, inst249_data, inst257_data, inst258_data, inst266_data, inst267_data,
       inst275_data, inst276_data, inst284_data, inst285_data, inst293_data, inst294_data, inst302_data,
       inst303_data, inst311_data, inst312_data, inst320_data, inst321_data, inst329_data, inst330_data,
       inst338_data, inst339_data, inst347_data, inst348_data, inst356_data, inst357_data, inst365_data,
       inst366_data, inst367_data, inst368_data, inst369_data, inst370_data, inst371_data, inst372_data,
       inst373_data, inst374_data, inst375_data, inst376_data, inst377_data, inst378_data, inst379_data,
       inst380_data, inst381_data, inst382_data, inst383_data, inst384_data, inst385_data, inst386_data,
       inst387_data, inst388_data, inst389_data, inst390_data, inst391_data, inst392_data, inst393_data,
       inst394_data, inst395_data, inst396_data, inst411_data, inst412_data, inst413_data, inst414_data,
       inst422_data, inst423_data, inst424_data, inst425_data, inst426_data, inst427_data, inst428_data,
       inst429_data, inst437_data, inst438_data, inst439_data, inst440_data, inst463_data, inst464_data,
       inst465_data, inst466_data, inst467_data, inst468_data, inst469_data, inst470_data, inst471_data,
       inst472_data, inst476_data, inst477_data, inst478_data, inst479_data, inst483_data, inst484_data,
       inst507_data, inst508_data, inst511_data, inst512_data, inst515_data, inst516_data, inst522_data,
       inst523_data, inst527_data, inst528_data, inst551_data, inst552_data, inst553_data, inst554_data,
       inst555_data, inst556_data, inst557_data, inst558_data, inst559_data, inst560_data, inst564_data,
       inst565_data, inst566_data, inst567_data, inst571_data, inst572_data, inst595_data, inst596_data,
       inst598_data, inst599_data, inst600_data, inst601_data, inst602_data, inst603_data, inst604_data,
       inst605_data, inst608_data, inst609_data, inst610_data, inst611_data, inst615_data, inst616_data,
       inst639_data, inst640_data, inst641_data, inst642_data, inst643_data, inst644_data, inst645_data,
       inst646_data, inst647_data, inst648_data, inst652_data, inst653_data, inst654_data, inst655_data,
       inst659_data, inst660_data, inst664_data, inst665_data, inst669_data, inst670_data, inst674_data,
       inst675_data, inst679_data, inst680_data, inst684_data, inst685_data, inst689_data, inst690_data,
       inst691_data, inst692_data, inst696_data, inst697_data, inst703_data, inst704_data, inst712_data,
       inst713_data, inst724_data, inst725_data, inst726_data, inst727_data, inst736_data, inst737_data,
       inst748_data, inst749_data, inst750_data, inst751_data, inst766_data, inst767_data, inst774_data,
       inst775_data, inst778_data, inst779_data, inst780_data, inst781_data, inst802_data, inst803_data,
       inst832_data, inst833_data, inst834_data, inst835_data, inst838_data, inst839_data, inst840_data,
       inst841_data, inst845_data, inst846_data, inst850_data, inst851_data, inst855_data, inst856_data,
       inst857_data, inst858_data, inst862_data, inst863_data, inst867_data, inst868_data, inst872_data,
       inst873_data, inst874_data, inst875_data, inst879_data, inst880_data, inst884_data, inst885_data,
       inst889_data, inst890_data, inst891_data, inst892_data, inst896_data, inst897_data, inst901_data,
       inst902_data, inst906_data, inst907_data, inst908_data, inst909_data, inst913_data, inst914_data,
       inst918_data, inst919_data, inst923_data, inst924_data, inst927_data, inst928_data, inst931_data,
       inst932_data, inst935_data, inst936_data, inst939_data, inst940_data, inst943_data, inst944_data,
       inst945_data, inst946_data, inst949_data, inst950_data, inst953_data, inst954_data, inst957_data,
       inst958_data, inst961_data, inst962_data, inst_data;

  CMPX #(.size(10)) inst214 (.A(Y), .B(inst219_data), .gr(inst214_gr));  // open: ls, eq
  CMPX #(.size(10)) inst410 (.A(Y), .B(inst413_data), .gr(inst410_gr));  // open: ls, eq
  CMPX #(.size(10)) inst199 (.A(X), .B(inst206_data), .gr(inst199_gr));  // open: ls, eq
  CMPX #(.size(10)) inst205 (.A(Y), .B(inst217_data), .gr(inst205_gr));  // open: ls, eq
  CMPX #(.size(10)) inst208 (.A(X), .B(inst215_data), .gr(inst208_gr));  // open: ls, eq
  CMPX #(.size(10)) inst221 (.A(X), .B(inst230_data), .gr(inst221_gr));  // open: ls, eq
  CMPX #(.size(10)) inst227 (.A(Y), .B(inst228_data), .gr(inst227_gr));  // open: ls, eq
  CMPX #(.size(10)) inst397 (.A(X), .B(inst424_data), .gr(inst397_gr));  // open: ls, eq
  CMPX #(.size(10)) inst403 (.A(Y), .B(inst411_data), .gr(inst403_gr));  // open: ls, eq
  CMPX #(.size(10)) inst404 (.A(X), .B(inst426_data), .gr(inst404_gr));  // open: ls, eq
  CMPX #(.size(10)) inst415 (.A(X), .B(inst428_data), .gr(inst415_gr));  // open: ls, eq
  CMPX #(.size(10)) inst421 (.A(Y), .B(inst422_data), .gr(inst421_gr));  // open: ls, eq
  CMPX #(.size(10)) inst430 (.A(X), .B(inst439_data), .gr(inst430_gr));  // open: ls, eq
  CMPX #(.size(10)) inst436 (.A(Y), .B(inst437_data), .gr(inst436_gr));  // open: ls, eq
  CMPX #(.size(10)) inst509 (.A(Y), .B(inst602_data), .gr(inst509_gr));  // open: ls, eq
  CMPX #(.size(10)) inst941 (.A(X), .B(inst943_data), .gr(inst941_gr));  // open: ls, eq
  CMPX #(.size(10)) inst520 (.A(Y), .B(inst608_data), .gr(inst520_gr));  // open: ls, eq
  CMPX #(.size(10)) inst4 (.A(X), .B(inst_data), .gr(inst4_gr));  // open: ls, eq
  CMPX #(.size(10)) inst118 (.A(Y), .B(inst3_data), .gr(inst118_gr));  // open: ls, eq
  CMPX #(.size(10)) inst11 (.A(X), .B(inst17_data), .gr(inst11_gr));  // open: ls, eq
  CMPX #(.size(10)) inst119 (.A(Y), .B(inst19_data), .gr(inst119_gr));  // open: ls, eq
  CMPX #(.size(10)) inst120 (.A(Y), .B(inst29_data), .gr(inst120_gr));  // open: ls, eq
  CONSTX #(.size(10), .\const (655)) inst206 (.data(inst206_data));
  CONSTX #(.size(10), .\const (0)) inst217 (.data(inst217_data));
  CONSTX #(.size(10), .\const (705)) inst215 (.data(inst215_data));
  CONSTX #(.size(10), .\const (0)) inst219 (.data(inst219_data));
  CONSTX #(.size(10), .\const (0)) inst228 (.data(inst228_data));
  CONSTX #(.size(10), .\const (0)) inst424 (.data(inst424_data));
  CONSTX #(.size(10), .\const (50)) inst411 (.data(inst411_data));
  CONSTX #(.size(10), .\const (25)) inst426 (.data(inst426_data));
  CONSTX #(.size(10), .\const (50)) inst413 (.data(inst413_data));
  CONSTX #(.size(10), .\const (50)) inst422 (.data(inst422_data));
  CONSTX #(.size(10), .\const (125)) inst439 (.data(inst439_data));
  CONSTX #(.size(10), .\const (50)) inst437 (.data(inst437_data));
  CMPX #(.size(10)) inst488 (.A(X), .B(inst598_data), .gr(inst488_gr));  // open: ls, eq
  CONSTX #(.size(10), .\const (50)) inst608 (.data(inst608_data));
  CMPX #(.size(10)) inst521 (.A(X), .B(inst691_data), .gr(inst521_gr));  // open: ls, eq
  CMPX #(.size(10)) inst695 (.A(Y), .B(inst696_data), .gr(inst695_gr));  // open: ls, eq
  CMPX #(.size(10)) inst959 (.A(X), .B(inst961_data), .gr(inst959_gr));  // open: ls, eq
  CMPX #(.size(10)) inst702 (.A(Y), .B(inst703_data), .gr(inst702_gr));  // open: ls, eq
  CONSTX #(.size(10), .\const (0)) inst (.data(inst_data));
  CONSTX #(.size(10), .\const (0)) inst3 (.data(inst3_data));
  CONSTX #(.size(10), .\const (50)) inst17 (.data(inst17_data));
  CONSTX #(.size(10), .\const (0)) inst19 (.data(inst19_data));
  CMPX #(.size(10)) inst21 (.A(X), .B(inst27_data), .gr(inst21_gr));  // open: ls, eq
  CONSTX #(.size(10), .\const (755)) inst230 (.data(inst230_data));
  CONSTX #(.size(10), .\const (75)) inst428 (.data(inst428_data));
  CONSTX #(.size(10), .\const (650)) inst598 (.data(inst598_data));
  CONSTX #(.size(10), .\const (50)) inst602 (.data(inst602_data));
  CONSTX #(.size(10), .\const (675)) inst943 (.data(inst943_data));
  CONSTX #(.size(10), .\const (725)) inst691 (.data(inst691_data));
  CONSTX #(.size(10), .\const (50)) inst696 (.data(inst696_data));
  CONSTX #(.size(10), .\const (775)) inst961 (.data(inst961_data));
  CONSTX #(.size(10), .\const (50)) inst703 (.data(inst703_data));
  CONSTX #(.size(10), .\const (100)) inst27 (.data(inst27_data));
  CONSTX #(.size(10), .\const (0)) inst29 (.data(inst29_data));
  CMPX #(.size(10)) inst200 (.A(X), .B(inst207_data), .ls(inst200_ls));  // open: eq, gr
  CMPX #(.size(10)) inst202 (.A(Y), .B(inst218_data), .ls(inst202_ls));  // open: eq, gr
  CMPX #(.size(10)) inst209 (.A(X), .B(inst216_data), .ls(inst209_ls));  // open: eq, gr
  CMPX #(.size(10)) inst211 (.A(Y), .B(inst220_data), .ls(inst211_ls));  // open: eq, gr
  CMPX #(.size(10)) inst398 (.A(X), .B(inst425_data), .ls(inst398_ls));  // open: eq, gr
  CMPX #(.size(10)) inst400 (.A(Y), .B(inst412_data), .ls(inst400_ls));  // open: eq, gr
  CMPX #(.size(10)) inst405 (.A(X), .B(inst427_data), .ls(inst405_ls));  // open: eq, gr
  CMPX #(.size(10)) inst407 (.A(Y), .B(inst414_data), .ls(inst407_ls));  // open: eq, gr
  CMPX #(.size(10)) inst431 (.A(X), .B(inst440_data), .ls(inst431_ls));  // open: eq, gr
  CMPX #(.size(10)) inst5 (.A(X), .B(inst2_data), .ls(inst5_ls));  // open: eq, gr
  CMPX #(.size(10)) inst12 (.A(X), .B(inst18_data), .ls(inst12_ls));  // open: eq, gr
  CMPX #(.size(10)) inst14 (.A(Y), .B(inst20_data), .ls(inst14_ls));  // open: eq, gr
  CONSTX #(.size(10), .\const (750)) inst216 (.data(inst216_data));
  and inst210 (inst210_out, inst209_ls, inst208_gr);
  CONSTX #(.size(10), .\const (45)) inst220 (.data(inst220_data));
  and inst212 (inst212_out, inst211_ls, inst214_gr);
  CMPX #(.size(10)) inst222 (.A(X), .B(inst231_data), .ls(inst222_ls));  // open: eq, gr
  CMPX #(.size(10)) inst224 (.A(Y), .B(inst229_data), .ls(inst224_ls));  // open: eq, gr
  CONSTX #(.size(10), .\const (70)) inst427 (.data(inst427_data));
  and inst406 (inst406_out, inst405_ls, inst404_gr);
  CONSTX #(.size(10), .\const (95)) inst414 (.data(inst414_data));
  and inst408 (inst408_out, inst407_ls, inst410_gr);
  CMPX #(.size(10)) inst416 (.A(X), .B(inst429_data), .ls(inst416_ls));  // open: eq, gr
  CMPX #(.size(10)) inst418 (.A(Y), .B(inst423_data), .ls(inst418_ls));  // open: eq, gr
  CMPX #(.size(10)) inst433 (.A(Y), .B(inst438_data), .ls(inst433_ls));  // open: eq, gr
  CMPX #(.size(10)) inst489 (.A(X), .B(inst601_data), .ls(inst489_ls));  // open: eq, gr
  CMPX #(.size(10)) inst495 (.A(Y), .B(inst605_data), .ls(inst495_ls));  // open: eq, gr
  CMPX #(.size(10)) inst942 (.A(X), .B(inst944_data), .ls(inst942_ls));  // open: eq, gr
  CMPX #(.size(10)) inst517 (.A(Y), .B(inst609_data), .ls(inst517_ls));  // open: eq, gr
  CMPX #(.size(10)) inst576 (.A(X), .B(inst692_data), .ls(inst576_ls));  // open: eq, gr
  CMPX #(.size(10)) inst693 (.A(Y), .B(inst697_data), .ls(inst693_ls));  // open: eq, gr
  CMPX #(.size(10)) inst960 (.A(X), .B(inst962_data), .ls(inst960_ls));  // open: eq, gr
  CMPX #(.size(10)) inst700 (.A(Y), .B(inst704_data), .ls(inst700_ls));  // open: eq, gr
  CMPX #(.size(10)) inst8 (.A(Y), .B(inst7_data), .ls(inst8_ls));  // open: eq, gr
  CONSTX #(.size(10), .\const (95)) inst18 (.data(inst18_data));
  CONSTX #(.size(10), .\const (45)) inst20 (.data(inst20_data));
  and inst15 (inst15_out, inst14_ls, inst119_gr);
  CMPX #(.size(10)) inst22 (.A(X), .B(inst28_data), .ls(inst22_ls));  // open: eq, gr
  CMPX #(.size(10)) inst24 (.A(Y), .B(inst30_data), .ls(inst24_ls));  // open: eq, gr
  CONSTX #(.size(10), .\const (700)) inst207 (.data(inst207_data));
  and inst201 (inst201_out, inst200_ls, inst199_gr);
  CONSTX #(.size(10), .\const (45)) inst218 (.data(inst218_data));
  and inst203 (inst203_out, inst202_ls, inst205_gr);
  CONSTX #(.size(10), .\const (800)) inst231 (.data(inst231_data));
  and inst223 (inst223_out, inst222_ls, inst221_gr);
  CONSTX #(.size(10), .\const (45)) inst229 (.data(inst229_data));
  and inst225 (inst225_out, inst224_ls, inst227_gr);
  CONSTX #(.size(10), .\const (20)) inst425 (.data(inst425_data));
  and inst399 (inst399_out, inst398_ls, inst397_gr);
  CONSTX #(.size(10), .\const (95)) inst412 (.data(inst412_data));
  and inst401 (inst401_out, inst400_ls, inst403_gr);
  CONSTX #(.size(10), .\const (120)) inst429 (.data(inst429_data));
  and inst417 (inst417_out, inst416_ls, inst415_gr);
  CONSTX #(.size(10), .\const (95)) inst423 (.data(inst423_data));
  and inst419 (inst419_out, inst418_ls, inst421_gr);
  CONSTX #(.size(10), .\const (150)) inst440 (.data(inst440_data));
  and inst432 (inst432_out, inst431_ls, inst430_gr);
  CONSTX #(.size(10), .\const (95)) inst438 (.data(inst438_data));
  and inst434 (inst434_out, inst433_ls, inst436_gr);
  CONSTX #(.size(10), .\const (670)) inst601 (.data(inst601_data));
  and inst491 (inst491_out, inst489_ls, inst488_gr);
  CONSTX #(.size(10), .\const (95)) inst605 (.data(inst605_data));
  and inst496 (inst496_out, inst495_ls, inst509_gr);
  CONSTX #(.size(10), .\const (720)) inst944 (.data(inst944_data));
  and inst514 (inst514_out, inst942_ls, inst941_gr);
  CONSTX #(.size(10), .\const (95)) inst609 (.data(inst609_data));
  and inst518 (inst518_out, inst517_ls, inst520_gr);
  CONSTX #(.size(10), .\const (800)) inst962 (.data(inst962_data));
  CONSTX #(.size(10), .\const (95)) inst704 (.data(inst704_data));
  and inst701 (inst701_out, inst700_ls, inst702_gr);
  CONSTX #(.size(10), .\const (45)) inst2 (.data(inst2_data));
  and inst6 (inst6_out, inst5_ls, inst4_gr);
  CONSTX #(.size(10), .\const (45)) inst7 (.data(inst7_data));
  and inst9 (inst9_out, inst8_ls, inst118_gr);
  and inst13 (inst13_out, inst12_ls, inst11_gr);
  CONSTX #(.size(10), .\const (145)) inst28 (.data(inst28_data));
  and inst23 (inst23_out, inst22_ls, inst21_gr);
  CONSTX #(.size(10), .\const (45)) inst30 (.data(inst30_data));
  and inst25 (inst25_out, inst24_ls, inst120_gr);
  CONSTX #(.size(10), .\const (770)) inst692 (.data(inst692_data));
  and inst577 (inst577_out, inst576_ls, inst521_gr);
  CONSTX #(.size(10), .\const (95)) inst697 (.data(inst697_data));
  and inst694 (inst694_out, inst693_ls, inst695_gr);
  and inst586 (inst586_out, inst960_ls, inst959_gr);
  and inst204 (valid19, inst201_out, inst203_out);
  and inst213 (valid20, inst210_out, inst212_out);
  and inst226 (valid21, inst223_out, inst225_out);
  and inst402 (valid37, inst399_out, inst401_out);
  and inst409 (valid38, inst406_out, inst408_out);
  and inst420 (valid39, inst417_out, inst419_out);
  and inst435 (valid40, inst432_out, inst434_out);
  and inst519 (valid62, inst514_out, inst518_out);
  and inst10 (valid1, inst6_out, inst9_out);
  and inst16 (valid2, inst13_out, inst15_out);
  and inst498 (valid61, inst491_out, inst496_out);
  and inst579 (valid63, inst577_out, inst694_out);
  and inst597 (valid64, inst586_out, inst701_out);
  and inst26 (valid3, inst23_out, inst25_out);
  CMPX #(.size(10)) inst247 (.A(Y), .B(inst369_data), .gr(inst247_gr));  // open: ls, eq
  CMPX #(.size(10)) inst441 (.A(X), .B(inst463_data), .gr(inst441_gr));  // open: ls, eq
  CMPX #(.size(10)) inst447 (.A(Y), .B(inst465_data), .gr(inst447_gr));  // open: ls, eq
  CMPX #(.size(10)) inst448 (.A(X), .B(inst467_data), .gr(inst448_gr));  // open: ls, eq
  CMPX #(.size(10)) inst454 (.A(Y), .B(inst469_data), .gr(inst454_gr));  // open: ls, eq
  CMPX #(.size(10)) inst475 (.A(Y), .B(inst476_data), .gr(inst475_gr));  // open: ls, eq
  CMPX #(.size(10)) inst459 (.A(X), .B(inst478_data), .gr(inst459_gr));  // open: ls, eq
  CMPX #(.size(10)) inst482 (.A(Y), .B(inst483_data), .gr(inst482_gr));  // open: ls, eq
  CMPX #(.size(10)) inst844 (.A(Y), .B(inst845_data), .gr(inst844_gr));  // open: ls, eq
  CMPX #(.size(10)) inst232 (.A(X), .B(inst239_data), .gr(inst232_gr));  // open: ls, eq
  CMPX #(.size(10)) inst238 (.A(Y), .B(inst367_data), .gr(inst238_gr));  // open: ls, eq
  CMPX #(.size(10)) inst241 (.A(X), .B(inst248_data), .gr(inst241_gr));  // open: ls, eq
  CMPX #(.size(10)) inst250 (.A(X), .B(inst257_data), .gr(inst250_gr));  // open: ls, eq
  CMPX #(.size(10)) inst256 (.A(Y), .B(inst371_data), .gr(inst256_gr));  // open: ls, eq
  CONSTX #(.size(10), .\const (150)) inst465 (.data(inst465_data));
  CONSTX #(.size(10), .\const (25)) inst467 (.data(inst467_data));
  CONSTX #(.size(10), .\const (150)) inst469 (.data(inst469_data));
  CMPX #(.size(10)) inst455 (.A(X), .B(inst471_data), .gr(inst455_gr));  // open: ls, eq
  CONSTX #(.size(10), .\const (150)) inst483 (.data(inst483_data));
  CMPX #(.size(10)) inst705 (.A(X), .B(inst724_data), .gr(inst705_gr));  // open: ls, eq
  CMPX #(.size(10)) inst711 (.A(Y), .B(inst840_data), .gr(inst711_gr));  // open: ls, eq
  CMPX #(.size(10)) inst937 (.A(X), .B(inst939_data), .gr(inst937_gr));  // open: ls, eq
  CMPX #(.size(10)) inst606 (.A(X), .B(inst712_data), .gr(inst606_gr));  // open: ls, eq
  CMPX #(.size(10)) inst849 (.A(Y), .B(inst850_data), .gr(inst849_gr));  // open: ls, eq
  CMPX #(.size(10)) inst955 (.A(X), .B(inst957_data), .gr(inst955_gr));  // open: ls, eq
  CMPX #(.size(10)) inst854 (.A(Y), .B(inst855_data), .gr(inst854_gr));  // open: ls, eq
  CMPX #(.size(10)) inst31 (.A(X), .B(inst48_data), .gr(inst31_gr));  // open: ls, eq
  CMPX #(.size(10)) inst121 (.A(Y), .B(inst46_data), .gr(inst121_gr));  // open: ls, eq
  CMPX #(.size(10)) inst38 (.A(X), .B(inst44_data), .gr(inst38_gr));  // open: ls, eq
  CMPX #(.size(10)) inst122 (.A(Y), .B(inst49_data), .gr(inst122_gr));  // open: ls, eq
  CMPX #(.size(10)) inst123 (.A(Y), .B(inst57_data), .gr(inst123_gr));  // open: ls, eq
  CONSTX #(.size(10), .\const (655)) inst239 (.data(inst239_data));
  CONSTX #(.size(10), .\const (100)) inst367 (.data(inst367_data));
  CONSTX #(.size(10), .\const (705)) inst248 (.data(inst248_data));
  CONSTX #(.size(10), .\const (100)) inst369 (.data(inst369_data));
  CONSTX #(.size(10), .\const (100)) inst371 (.data(inst371_data));
  CONSTX #(.size(10), .\const (0)) inst463 (.data(inst463_data));
  CONSTX #(.size(10), .\const (75)) inst471 (.data(inst471_data));
  CONSTX #(.size(10), .\const (150)) inst476 (.data(inst476_data));
  CONSTX #(.size(10), .\const (125)) inst478 (.data(inst478_data));
  CONSTX #(.size(10), .\const (650)) inst724 (.data(inst724_data));
  CONSTX #(.size(10), .\const (150)) inst840 (.data(inst840_data));
  CONSTX #(.size(10), .\const (675)) inst939 (.data(inst939_data));
  CONSTX #(.size(10), .\const (150)) inst845 (.data(inst845_data));
  CONSTX #(.size(10), .\const (150)) inst850 (.data(inst850_data));
  CONSTX #(.size(10), .\const (775)) inst957 (.data(inst957_data));
  CONSTX #(.size(10), .\const (150)) inst855 (.data(inst855_data));
  CONSTX #(.size(10), .\const (0)) inst48 (.data(inst48_data));
  CONSTX #(.size(10), .\const (100)) inst46 (.data(inst46_data));
  CONSTX #(.size(10), .\const (50)) inst44 (.data(inst44_data));
  CONSTX #(.size(10), .\const (100)) inst49 (.data(inst49_data));
  CMPX #(.size(10)) inst51 (.A(X), .B(inst59_data), .gr(inst51_gr));  // open: ls, eq
  CONSTX #(.size(10), .\const (755)) inst257 (.data(inst257_data));
  CONSTX #(.size(10), .\const (725)) inst712 (.data(inst712_data));
  CONSTX #(.size(10), .\const (100)) inst59 (.data(inst59_data));
  CONSTX #(.size(10), .\const (100)) inst57 (.data(inst57_data));
  CMPX #(.size(10)) inst449 (.A(X), .B(inst468_data), .ls(inst449_ls));  // open: eq, gr
  CMPX #(.size(10)) inst451 (.A(Y), .B(inst470_data), .ls(inst451_ls));  // open: eq, gr
  CMPX #(.size(10)) inst233 (.A(X), .B(inst240_data), .ls(inst233_ls));  // open: eq, gr
  CMPX #(.size(10)) inst235 (.A(Y), .B(inst368_data), .ls(inst235_ls));  // open: eq, gr
  CMPX #(.size(10)) inst242 (.A(X), .B(inst249_data), .ls(inst242_ls));  // open: eq, gr
  CMPX #(.size(10)) inst244 (.A(Y), .B(inst370_data), .ls(inst244_ls));  // open: eq, gr
  CMPX #(.size(10)) inst442 (.A(X), .B(inst464_data), .ls(inst442_ls));  // open: eq, gr
  CMPX #(.size(10)) inst444 (.A(Y), .B(inst466_data), .ls(inst444_ls));  // open: eq, gr
  CONSTX #(.size(10), .\const (70)) inst468 (.data(inst468_data));
  CMPX #(.size(10)) inst456 (.A(X), .B(inst472_data), .ls(inst456_ls));  // open: eq, gr
  CMPX #(.size(10)) inst473 (.A(Y), .B(inst477_data), .ls(inst473_ls));  // open: eq, gr
  CMPX #(.size(10)) inst460 (.A(X), .B(inst479_data), .ls(inst460_ls));  // open: eq, gr
  CMPX #(.size(10)) inst480 (.A(Y), .B(inst484_data), .ls(inst480_ls));  // open: eq, gr
  CMPX #(.size(10)) inst706 (.A(X), .B(inst725_data), .ls(inst706_ls));  // open: eq, gr
  CMPX #(.size(10)) inst708 (.A(Y), .B(inst841_data), .ls(inst708_ls));  // open: eq, gr
  CMPX #(.size(10)) inst938 (.A(X), .B(inst940_data), .ls(inst938_ls));  // open: eq, gr
  CMPX #(.size(10)) inst842 (.A(Y), .B(inst846_data), .ls(inst842_ls));  // open: eq, gr
  CMPX #(.size(10)) inst956 (.A(X), .B(inst958_data), .ls(inst956_ls));  // open: eq, gr
  CMPX #(.size(10)) inst852 (.A(Y), .B(inst856_data), .ls(inst852_ls));  // open: eq, gr
  CMPX #(.size(10)) inst32 (.A(X), .B(inst37_data), .ls(inst32_ls));  // open: eq, gr
  CMPX #(.size(10)) inst39 (.A(X), .B(inst45_data), .ls(inst39_ls));  // open: eq, gr
  CMPX #(.size(10)) inst41 (.A(Y), .B(inst50_data), .ls(inst41_ls));  // open: eq, gr
  CONSTX #(.size(10), .\const (750)) inst249 (.data(inst249_data));
  and inst243 (inst243_out, inst242_ls, inst241_gr);
  CONSTX #(.size(10), .\const (145)) inst370 (.data(inst370_data));
  and inst245 (inst245_out, inst244_ls, inst247_gr);
  CMPX #(.size(10)) inst251 (.A(X), .B(inst258_data), .ls(inst251_ls));  // open: eq, gr
  CMPX #(.size(10)) inst253 (.A(Y), .B(inst372_data), .ls(inst253_ls));  // open: eq, gr
  CONSTX #(.size(10), .\const (20)) inst464 (.data(inst464_data));
  and inst443 (inst443_out, inst442_ls, inst441_gr);
  CONSTX #(.size(10), .\const (195)) inst466 (.data(inst466_data));
  and inst445 (inst445_out, inst444_ls, inst447_gr);
  and inst450 (inst450_out, inst449_ls, inst448_gr);
  CONSTX #(.size(10), .\const (195)) inst470 (.data(inst470_data));
  and inst452 (inst452_out, inst451_ls, inst454_gr);
  CONSTX #(.size(10), .\const (120)) inst472 (.data(inst472_data));
  and inst457 (inst457_out, inst456_ls, inst455_gr);
  CONSTX #(.size(10), .\const (195)) inst477 (.data(inst477_data));
  and inst474 (inst474_out, inst473_ls, inst475_gr);
  CONSTX #(.size(10), .\const (150)) inst479 (.data(inst479_data));
  and inst461 (inst461_out, inst460_ls, inst459_gr);
  CONSTX #(.size(10), .\const (195)) inst484 (.data(inst484_data));
  and inst481 (inst481_out, inst480_ls, inst482_gr);
  CONSTX #(.size(10), .\const (670)) inst725 (.data(inst725_data));
  CONSTX #(.size(10), .\const (720)) inst940 (.data(inst940_data));
  and inst714 (inst714_out, inst938_ls, inst937_gr);
  CONSTX #(.size(10), .\const (195)) inst846 (.data(inst846_data));
  and inst843 (inst843_out, inst842_ls, inst844_gr);
  CMPX #(.size(10)) inst607 (.A(X), .B(inst713_data), .ls(inst607_ls));  // open: eq, gr
  CMPX #(.size(10)) inst847 (.A(Y), .B(inst851_data), .ls(inst847_ls));  // open: eq, gr
  CMPX #(.size(10)) inst34 (.A(Y), .B(inst47_data), .ls(inst34_ls));  // open: eq, gr
  CONSTX #(.size(10), .\const (95)) inst45 (.data(inst45_data));
  CONSTX #(.size(10), .\const (145)) inst50 (.data(inst50_data));
  and inst42 (inst42_out, inst41_ls, inst122_gr);
  CMPX #(.size(10)) inst52 (.A(X), .B(inst60_data), .ls(inst52_ls));  // open: eq, gr
  CMPX #(.size(10)) inst54 (.A(Y), .B(inst58_data), .ls(inst54_ls));  // open: eq, gr
  CONSTX #(.size(10), .\const (700)) inst240 (.data(inst240_data));
  and inst234 (inst234_out, inst233_ls, inst232_gr);
  CONSTX #(.size(10), .\const (145)) inst368 (.data(inst368_data));
  and inst236 (inst236_out, inst235_ls, inst238_gr);
  CONSTX #(.size(10), .\const (800)) inst258 (.data(inst258_data));
  and inst252 (inst252_out, inst251_ls, inst250_gr);
  CONSTX #(.size(10), .\const (145)) inst372 (.data(inst372_data));
  and inst254 (inst254_out, inst253_ls, inst256_gr);
  and inst707 (inst707_out, inst706_ls, inst705_gr);
  CONSTX #(.size(10), .\const (195)) inst841 (.data(inst841_data));
  and inst709 (inst709_out, inst708_ls, inst711_gr);
  CONSTX #(.size(10), .\const (770)) inst713 (.data(inst713_data));
  and inst718 (inst718_out, inst607_ls, inst606_gr);
  CONSTX #(.size(10), .\const (195)) inst851 (.data(inst851_data));
  and inst848 (inst848_out, inst847_ls, inst849_gr);
  CONSTX #(.size(10), .\const (800)) inst958 (.data(inst958_data));
  and inst722 (inst722_out, inst956_ls, inst955_gr);
  CONSTX #(.size(10), .\const (195)) inst856 (.data(inst856_data));
  and inst853 (inst853_out, inst852_ls, inst854_gr);
  CONSTX #(.size(10), .\const (45)) inst37 (.data(inst37_data));
  and inst33 (inst33_out, inst32_ls, inst31_gr);
  CONSTX #(.size(10), .\const (145)) inst47 (.data(inst47_data));
  and inst35 (inst35_out, inst34_ls, inst121_gr);
  and inst40 (inst40_out, inst39_ls, inst38_gr);
  CONSTX #(.size(10), .\const (145)) inst60 (.data(inst60_data));
  and inst53 (inst53_out, inst52_ls, inst51_gr);
  CONSTX #(.size(10), .\const (145)) inst58 (.data(inst58_data));
  and inst55 (inst55_out, inst54_ls, inst123_gr);
  and inst446 (valid41, inst443_out, inst445_out);
  and inst453 (valid42, inst450_out, inst452_out);
  and inst462 (valid44, inst461_out, inst481_out);
  and inst237 (valid22, inst234_out, inst236_out);
  and inst246 (valid23, inst243_out, inst245_out);
  and inst255 (valid24, inst252_out, inst254_out);
  and inst458 (valid43, inst457_out, inst474_out);
  and inst710 (valid65, inst707_out, inst709_out);
  and inst715 (valid66, inst714_out, inst843_out);
  and inst719 (valid67, inst718_out, inst848_out);
  and inst723 (valid68, inst722_out, inst853_out);
  and inst36 (valid4, inst33_out, inst35_out);
  and inst43 (valid5, inst40_out, inst42_out);
  and inst56 (valid6, inst53_out, inst55_out);
  CMPX #(.size(10)) inst485 (.A(X), .B(inst507_data), .gr(inst485_gr));  // open: ls, eq
  CMPX #(.size(10)) inst673 (.A(Y), .B(inst674_data), .gr(inst673_gr));  // open: ls, eq
  CMPX #(.size(10)) inst492 (.A(X), .B(inst511_data), .gr(inst492_gr));  // open: ls, eq
  CMPX #(.size(10)) inst668 (.A(Y), .B(inst669_data), .gr(inst668_gr));  // open: ls, eq
  CMPX #(.size(10)) inst663 (.A(Y), .B(inst664_data), .gr(inst663_gr));  // open: ls, eq
  CMPX #(.size(10)) inst503 (.A(X), .B(inst522_data), .gr(inst503_gr));  // open: ls, eq
  CMPX #(.size(10)) inst526 (.A(Y), .B(inst527_data), .gr(inst526_gr));  // open: ls, eq
  CMPX #(.size(10)) inst933 (.A(X), .B(inst935_data), .gr(inst933_gr));  // open: ls, eq
  CMPX #(.size(10)) inst866 (.A(Y), .B(inst867_data), .gr(inst866_gr));  // open: ls, eq
  CMPX #(.size(10)) inst274 (.A(Y), .B(inst375_data), .gr(inst274_gr));  // open: ls, eq
  CONSTX #(.size(10), .\const (0)) inst507 (.data(inst507_data));
  CONSTX #(.size(10), .\const (250)) inst674 (.data(inst674_data));
  CONSTX #(.size(10), .\const (25)) inst511 (.data(inst511_data));
  CONSTX #(.size(10), .\const (250)) inst669 (.data(inst669_data));
  CMPX #(.size(10)) inst499 (.A(X), .B(inst515_data), .gr(inst499_gr));  // open: ls, eq
  CONSTX #(.size(10), .\const (250)) inst527 (.data(inst527_data));
  CMPX #(.size(10)) inst732 (.A(X), .B(inst748_data), .gr(inst732_gr));  // open: ls, eq
  CMPX #(.size(10)) inst871 (.A(Y), .B(inst872_data), .gr(inst871_gr));  // open: ls, eq
  CONSTX #(.size(10), .\const (250)) inst867 (.data(inst867_data));
  CMPX #(.size(10)) inst716 (.A(X), .B(inst726_data), .gr(inst716_gr));  // open: ls, eq
  CMPX #(.size(10)) inst861 (.A(Y), .B(inst862_data), .gr(inst861_gr));  // open: ls, eq
  CMPX #(.size(10)) inst951 (.A(X), .B(inst953_data), .gr(inst951_gr));  // open: ls, eq
  CMPX #(.size(10)) inst758 (.A(Y), .B(inst857_data), .gr(inst758_gr));  // open: ls, eq
  CMPX #(.size(10)) inst125 (.A(Y), .B(inst79_data), .gr(inst125_gr));  // open: ls, eq
  CMPX #(.size(10)) inst259 (.A(X), .B(inst266_data), .gr(inst259_gr));  // open: ls, eq
  CMPX #(.size(10)) inst265 (.A(Y), .B(inst373_data), .gr(inst265_gr));  // open: ls, eq
  CMPX #(.size(10)) inst268 (.A(X), .B(inst275_data), .gr(inst268_gr));  // open: ls, eq
  CMPX #(.size(10)) inst277 (.A(X), .B(inst284_data), .gr(inst277_gr));  // open: ls, eq
  CMPX #(.size(10)) inst283 (.A(Y), .B(inst377_data), .gr(inst283_gr));  // open: ls, eq
  CONSTX #(.size(10), .\const (75)) inst515 (.data(inst515_data));
  CONSTX #(.size(10), .\const (250)) inst664 (.data(inst664_data));
  CONSTX #(.size(10), .\const (125)) inst522 (.data(inst522_data));
  CONSTX #(.size(10), .\const (650)) inst748 (.data(inst748_data));
  CONSTX #(.size(10), .\const (250)) inst872 (.data(inst872_data));
  CONSTX #(.size(10), .\const (675)) inst935 (.data(inst935_data));
  CONSTX #(.size(10), .\const (725)) inst726 (.data(inst726_data));
  CONSTX #(.size(10), .\const (250)) inst862 (.data(inst862_data));
  CONSTX #(.size(10), .\const (775)) inst953 (.data(inst953_data));
  CONSTX #(.size(10), .\const (250)) inst857 (.data(inst857_data));
  CMPX #(.size(10)) inst61 (.A(X), .B(inst68_data), .gr(inst61_gr));  // open: ls, eq
  CMPX #(.size(10)) inst124 (.A(Y), .B(inst77_data), .gr(inst124_gr));  // open: ls, eq
  CMPX #(.size(10)) inst69 (.A(X), .B(inst75_data), .gr(inst69_gr));  // open: ls, eq
  CMPX #(.size(10)) inst81 (.A(X), .B(inst89_data), .gr(inst81_gr));  // open: ls, eq
  CMPX #(.size(10)) inst126 (.A(Y), .B(inst87_data), .gr(inst126_gr));  // open: ls, eq
  CONSTX #(.size(10), .\const (655)) inst266 (.data(inst266_data));
  CONSTX #(.size(10), .\const (200)) inst373 (.data(inst373_data));
  CONSTX #(.size(10), .\const (705)) inst275 (.data(inst275_data));
  CONSTX #(.size(10), .\const (200)) inst375 (.data(inst375_data));
  CONSTX #(.size(10), .\const (200)) inst377 (.data(inst377_data));
  CONSTX #(.size(10), .\const (0)) inst68 (.data(inst68_data));
  CONSTX #(.size(10), .\const (200)) inst77 (.data(inst77_data));
  CONSTX #(.size(10), .\const (50)) inst75 (.data(inst75_data));
  CONSTX #(.size(10), .\const (200)) inst79 (.data(inst79_data));
  CONSTX #(.size(10), .\const (200)) inst87 (.data(inst87_data));
  CONSTX #(.size(10), .\const (755)) inst284 (.data(inst284_data));
  CONSTX #(.size(10), .\const (100)) inst89 (.data(inst89_data));
  CMPX #(.size(10)) inst486 (.A(X), .B(inst508_data), .ls(inst486_ls));  // open: eq, gr
  CMPX #(.size(10)) inst493 (.A(X), .B(inst512_data), .ls(inst493_ls));  // open: eq, gr
  CMPX #(.size(10)) inst666 (.A(Y), .B(inst670_data), .ls(inst666_ls));  // open: eq, gr
  CMPX #(.size(10)) inst671 (.A(Y), .B(inst675_data), .ls(inst671_ls));  // open: eq, gr
  CONSTX #(.size(10), .\const (70)) inst512 (.data(inst512_data));
  CONSTX #(.size(10), .\const (295)) inst670 (.data(inst670_data));
  and inst667 (inst667_out, inst666_ls, inst668_gr);
  CMPX #(.size(10)) inst500 (.A(X), .B(inst516_data), .ls(inst500_ls));  // open: eq, gr
  CMPX #(.size(10)) inst661 (.A(Y), .B(inst665_data), .ls(inst661_ls));  // open: eq, gr
  CMPX #(.size(10)) inst504 (.A(X), .B(inst523_data), .ls(inst504_ls));  // open: eq, gr
  CMPX #(.size(10)) inst524 (.A(Y), .B(inst528_data), .ls(inst524_ls));  // open: eq, gr
  CMPX #(.size(10)) inst733 (.A(X), .B(inst749_data), .ls(inst733_ls));  // open: eq, gr
  CMPX #(.size(10)) inst869 (.A(Y), .B(inst873_data), .ls(inst869_ls));  // open: eq, gr
  CMPX #(.size(10)) inst934 (.A(X), .B(inst936_data), .ls(inst934_ls));  // open: eq, gr
  CMPX #(.size(10)) inst864 (.A(Y), .B(inst868_data), .ls(inst864_ls));  // open: eq, gr
  CMPX #(.size(10)) inst717 (.A(X), .B(inst727_data), .ls(inst717_ls));  // open: eq, gr
  CMPX #(.size(10)) inst952 (.A(X), .B(inst954_data), .ls(inst952_ls));  // open: eq, gr
  CMPX #(.size(10)) inst756 (.A(Y), .B(inst858_data), .ls(inst756_ls));  // open: eq, gr
  CMPX #(.size(10)) inst260 (.A(X), .B(inst267_data), .ls(inst260_ls));  // open: eq, gr
  CMPX #(.size(10)) inst262 (.A(Y), .B(inst374_data), .ls(inst262_ls));  // open: eq, gr
  CMPX #(.size(10)) inst269 (.A(X), .B(inst276_data), .ls(inst269_ls));  // open: eq, gr
  CMPX #(.size(10)) inst271 (.A(Y), .B(inst376_data), .ls(inst271_ls));  // open: eq, gr
  CONSTX #(.size(10), .\const (20)) inst508 (.data(inst508_data));
  and inst487 (inst487_out, inst486_ls, inst485_gr);
  CONSTX #(.size(10), .\const (295)) inst675 (.data(inst675_data));
  and inst672 (inst672_out, inst671_ls, inst673_gr);
  and inst494 (inst494_out, inst493_ls, inst492_gr);
  CONSTX #(.size(10), .\const (120)) inst516 (.data(inst516_data));
  and inst501 (inst501_out, inst500_ls, inst499_gr);
  CONSTX #(.size(10), .\const (295)) inst665 (.data(inst665_data));
  and inst662 (inst662_out, inst661_ls, inst663_gr);
  CONSTX #(.size(10), .\const (150)) inst523 (.data(inst523_data));
  and inst505 (inst505_out, inst504_ls, inst503_gr);
  CONSTX #(.size(10), .\const (295)) inst528 (.data(inst528_data));
  and inst525 (inst525_out, inst524_ls, inst526_gr);
  CONSTX #(.size(10), .\const (670)) inst749 (.data(inst749_data));
  CONSTX #(.size(10), .\const (295)) inst873 (.data(inst873_data));
  and inst870 (inst870_out, inst869_ls, inst871_gr);
  CONSTX #(.size(10), .\const (720)) inst936 (.data(inst936_data));
  and inst738 (inst738_out, inst934_ls, inst933_gr);
  CONSTX #(.size(10), .\const (295)) inst868 (.data(inst868_data));
  and inst865 (inst865_out, inst864_ls, inst866_gr);
  CMPX #(.size(10)) inst859 (.A(Y), .B(inst863_data), .ls(inst859_ls));  // open: eq, gr
  CONSTX #(.size(10), .\const (800)) inst954 (.data(inst954_data));
  CMPX #(.size(10)) inst62 (.A(X), .B(inst67_data), .ls(inst62_ls));  // open: eq, gr
  CMPX #(.size(10)) inst64 (.A(Y), .B(inst78_data), .ls(inst64_ls));  // open: eq, gr
  CMPX #(.size(10)) inst70 (.A(X), .B(inst76_data), .ls(inst70_ls));  // open: eq, gr
  CMPX #(.size(10)) inst72 (.A(Y), .B(inst80_data), .ls(inst72_ls));  // open: eq, gr
  CONSTX #(.size(10), .\const (700)) inst267 (.data(inst267_data));
  CONSTX #(.size(10), .\const (750)) inst276 (.data(inst276_data));
  and inst270 (inst270_out, inst269_ls, inst268_gr);
  CONSTX #(.size(10), .\const (245)) inst376 (.data(inst376_data));
  and inst272 (inst272_out, inst271_ls, inst274_gr);
  CMPX #(.size(10)) inst278 (.A(X), .B(inst285_data), .ls(inst278_ls));  // open: eq, gr
  CMPX #(.size(10)) inst280 (.A(Y), .B(inst378_data), .ls(inst280_ls));  // open: eq, gr
  and inst734 (inst734_out, inst733_ls, inst732_gr);
  CONSTX #(.size(10), .\const (770)) inst727 (.data(inst727_data));
  and inst742 (inst742_out, inst717_ls, inst716_gr);
  CONSTX #(.size(10), .\const (295)) inst863 (.data(inst863_data));
  and inst860 (inst860_out, inst859_ls, inst861_gr);
  and inst746 (inst746_out, inst952_ls, inst951_gr);
  CONSTX #(.size(10), .\const (295)) inst858 (.data(inst858_data));
  and inst757 (inst757_out, inst756_ls, inst758_gr);
  CONSTX #(.size(10), .\const (95)) inst76 (.data(inst76_data));
  and inst71 (inst71_out, inst70_ls, inst69_gr);
  CONSTX #(.size(10), .\const (245)) inst80 (.data(inst80_data));
  and inst73 (inst73_out, inst72_ls, inst125_gr);
  CMPX #(.size(10)) inst82 (.A(X), .B(inst90_data), .ls(inst82_ls));  // open: eq, gr
  CMPX #(.size(10)) inst84 (.A(Y), .B(inst88_data), .ls(inst84_ls));  // open: eq, gr
  and inst261 (inst261_out, inst260_ls, inst259_gr);
  CONSTX #(.size(10), .\const (245)) inst374 (.data(inst374_data));
  and inst263 (inst263_out, inst262_ls, inst265_gr);
  CONSTX #(.size(10), .\const (800)) inst285 (.data(inst285_data));
  and inst279 (inst279_out, inst278_ls, inst277_gr);
  CONSTX #(.size(10), .\const (245)) inst378 (.data(inst378_data));
  and inst281 (inst281_out, inst280_ls, inst283_gr);
  CONSTX #(.size(10), .\const (45)) inst67 (.data(inst67_data));
  and inst63 (inst63_out, inst62_ls, inst61_gr);
  CONSTX #(.size(10), .\const (245)) inst78 (.data(inst78_data));
  and inst65 (inst65_out, inst64_ls, inst124_gr);
  CONSTX #(.size(10), .\const (145)) inst90 (.data(inst90_data));
  and inst83 (inst83_out, inst82_ls, inst81_gr);
  CONSTX #(.size(10), .\const (245)) inst88 (.data(inst88_data));
  and inst85 (inst85_out, inst84_ls, inst126_gr);
  and inst490 (valid45, inst487_out, inst672_out);
  and inst497 (valid46, inst494_out, inst667_out);
  and inst506 (valid48, inst505_out, inst525_out);
  and inst739 (valid70, inst738_out, inst865_out);
  and inst502 (valid47, inst501_out, inst662_out);
  and inst735 (valid69, inst734_out, inst870_out);
  and inst743 (valid71, inst742_out, inst860_out);
  and inst747 (valid72, inst746_out, inst757_out);
  and inst264 (valid25, inst261_out, inst263_out);
  and inst273 (valid26, inst270_out, inst272_out);
  and inst282 (valid27, inst279_out, inst281_out);
  and inst66 (valid7, inst63_out, inst65_out);
  and inst74 (valid8, inst71_out, inst73_out);
  and inst86 (valid9, inst83_out, inst85_out);
  CMPX #(.size(10)) inst542 (.A(Y), .B(inst557_data), .gr(inst542_gr));  // open: ls, eq
  CMPX #(.size(10)) inst529 (.A(X), .B(inst551_data), .gr(inst529_gr));  // open: ls, eq
  CMPX #(.size(10)) inst535 (.A(Y), .B(inst553_data), .gr(inst535_gr));  // open: ls, eq
  CMPX #(.size(10)) inst536 (.A(X), .B(inst555_data), .gr(inst536_gr));  // open: ls, eq
  CONSTX #(.size(10), .\const (350)) inst557 (.data(inst557_data));
  CMPX #(.size(10)) inst543 (.A(X), .B(inst559_data), .gr(inst543_gr));  // open: ls, eq
  CMPX #(.size(10)) inst563 (.A(Y), .B(inst564_data), .gr(inst563_gr));  // open: ls, eq
  CMPX #(.size(10)) inst547 (.A(X), .B(inst566_data), .gr(inst547_gr));  // open: ls, eq
  CMPX #(.size(10)) inst570 (.A(Y), .B(inst571_data), .gr(inst570_gr));  // open: ls, eq
  CMPX #(.size(10)) inst765 (.A(Y), .B(inst874_data), .gr(inst765_gr));  // open: ls, eq
  CMPX #(.size(10)) inst929 (.A(X), .B(inst931_data), .gr(inst929_gr));  // open: ls, eq
  CMPX #(.size(10)) inst878 (.A(Y), .B(inst879_data), .gr(inst878_gr));  // open: ls, eq
  CMPX #(.size(10)) inst883 (.A(Y), .B(inst884_data), .gr(inst883_gr));  // open: ls, eq
  CMPX #(.size(10)) inst888 (.A(Y), .B(inst889_data), .gr(inst888_gr));  // open: ls, eq
  CONSTX #(.size(10), .\const (0)) inst551 (.data(inst551_data));
  CONSTX #(.size(10), .\const (350)) inst553 (.data(inst553_data));
  CONSTX #(.size(10), .\const (25)) inst555 (.data(inst555_data));
  CONSTX #(.size(10), .\const (350)) inst564 (.data(inst564_data));
  CONSTX #(.size(10), .\const (125)) inst566 (.data(inst566_data));
  CONSTX #(.size(10), .\const (350)) inst571 (.data(inst571_data));
  CMPX #(.size(10)) inst759 (.A(X), .B(inst778_data), .gr(inst759_gr));  // open: ls, eq
  CONSTX #(.size(10), .\const (350)) inst879 (.data(inst879_data));
  CMPX #(.size(10)) inst728 (.A(X), .B(inst736_data), .gr(inst728_gr));  // open: ls, eq
  CONSTX #(.size(10), .\const (350)) inst884 (.data(inst884_data));
  CMPX #(.size(10)) inst947 (.A(X), .B(inst949_data), .gr(inst947_gr));  // open: ls, eq
  CONSTX #(.size(10), .\const (350)) inst889 (.data(inst889_data));
  CONSTX #(.size(10), .\const (75)) inst559 (.data(inst559_data));
  CONSTX #(.size(10), .\const (650)) inst778 (.data(inst778_data));
  CONSTX #(.size(10), .\const (350)) inst874 (.data(inst874_data));
  CONSTX #(.size(10), .\const (675)) inst931 (.data(inst931_data));
  CONSTX #(.size(10), .\const (725)) inst736 (.data(inst736_data));
  CONSTX #(.size(10), .\const (775)) inst949 (.data(inst949_data));
  CMPX #(.size(10)) inst295 (.A(X), .B(inst302_data), .gr(inst295_gr));  // open: ls, eq
  CMPX #(.size(10)) inst301 (.A(Y), .B(inst381_data), .gr(inst301_gr));  // open: ls, eq
  CMPX #(.size(10)) inst128 (.A(Y), .B(inst109_data), .gr(inst128_gr));  // open: ls, eq
  CMPX #(.size(10)) inst286 (.A(X), .B(inst293_data), .gr(inst286_gr));  // open: ls, eq
  CMPX #(.size(10)) inst292 (.A(Y), .B(inst383_data), .gr(inst292_gr));  // open: ls, eq
  CONSTX #(.size(10), .\const (300)) inst381 (.data(inst381_data));
  CMPX #(.size(10)) inst304 (.A(X), .B(inst311_data), .gr(inst304_gr));  // open: ls, eq
  CMPX #(.size(10)) inst310 (.A(Y), .B(inst379_data), .gr(inst310_gr));  // open: ls, eq
  CMPX #(.size(10)) inst530 (.A(X), .B(inst552_data), .ls(inst530_ls));  // open: eq, gr
  CMPX #(.size(10)) inst532 (.A(Y), .B(inst554_data), .ls(inst532_ls));  // open: eq, gr
  CMPX #(.size(10)) inst537 (.A(X), .B(inst556_data), .ls(inst537_ls));  // open: eq, gr
  CMPX #(.size(10)) inst539 (.A(Y), .B(inst558_data), .ls(inst539_ls));  // open: eq, gr
  CMPX #(.size(10)) inst561 (.A(Y), .B(inst565_data), .ls(inst561_ls));  // open: eq, gr
  CMPX #(.size(10)) inst548 (.A(X), .B(inst567_data), .ls(inst548_ls));  // open: eq, gr
  CMPX #(.size(10)) inst568 (.A(Y), .B(inst572_data), .ls(inst568_ls));  // open: eq, gr
